# EAGLE schematic combined-v2 (EAGLE 9.6.2)
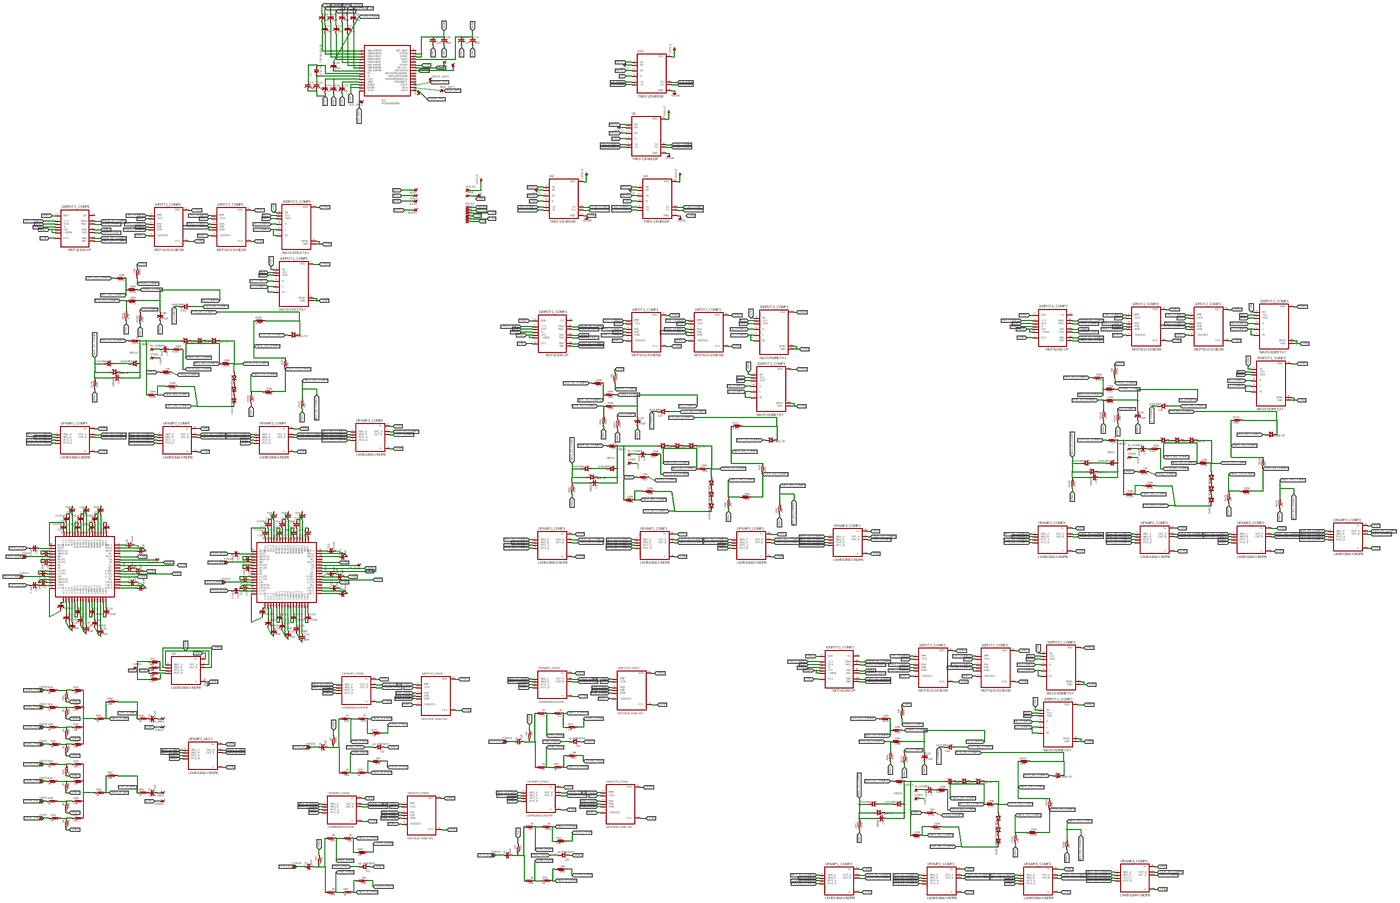
[diagram p0: schematic, sheet 1, overview]
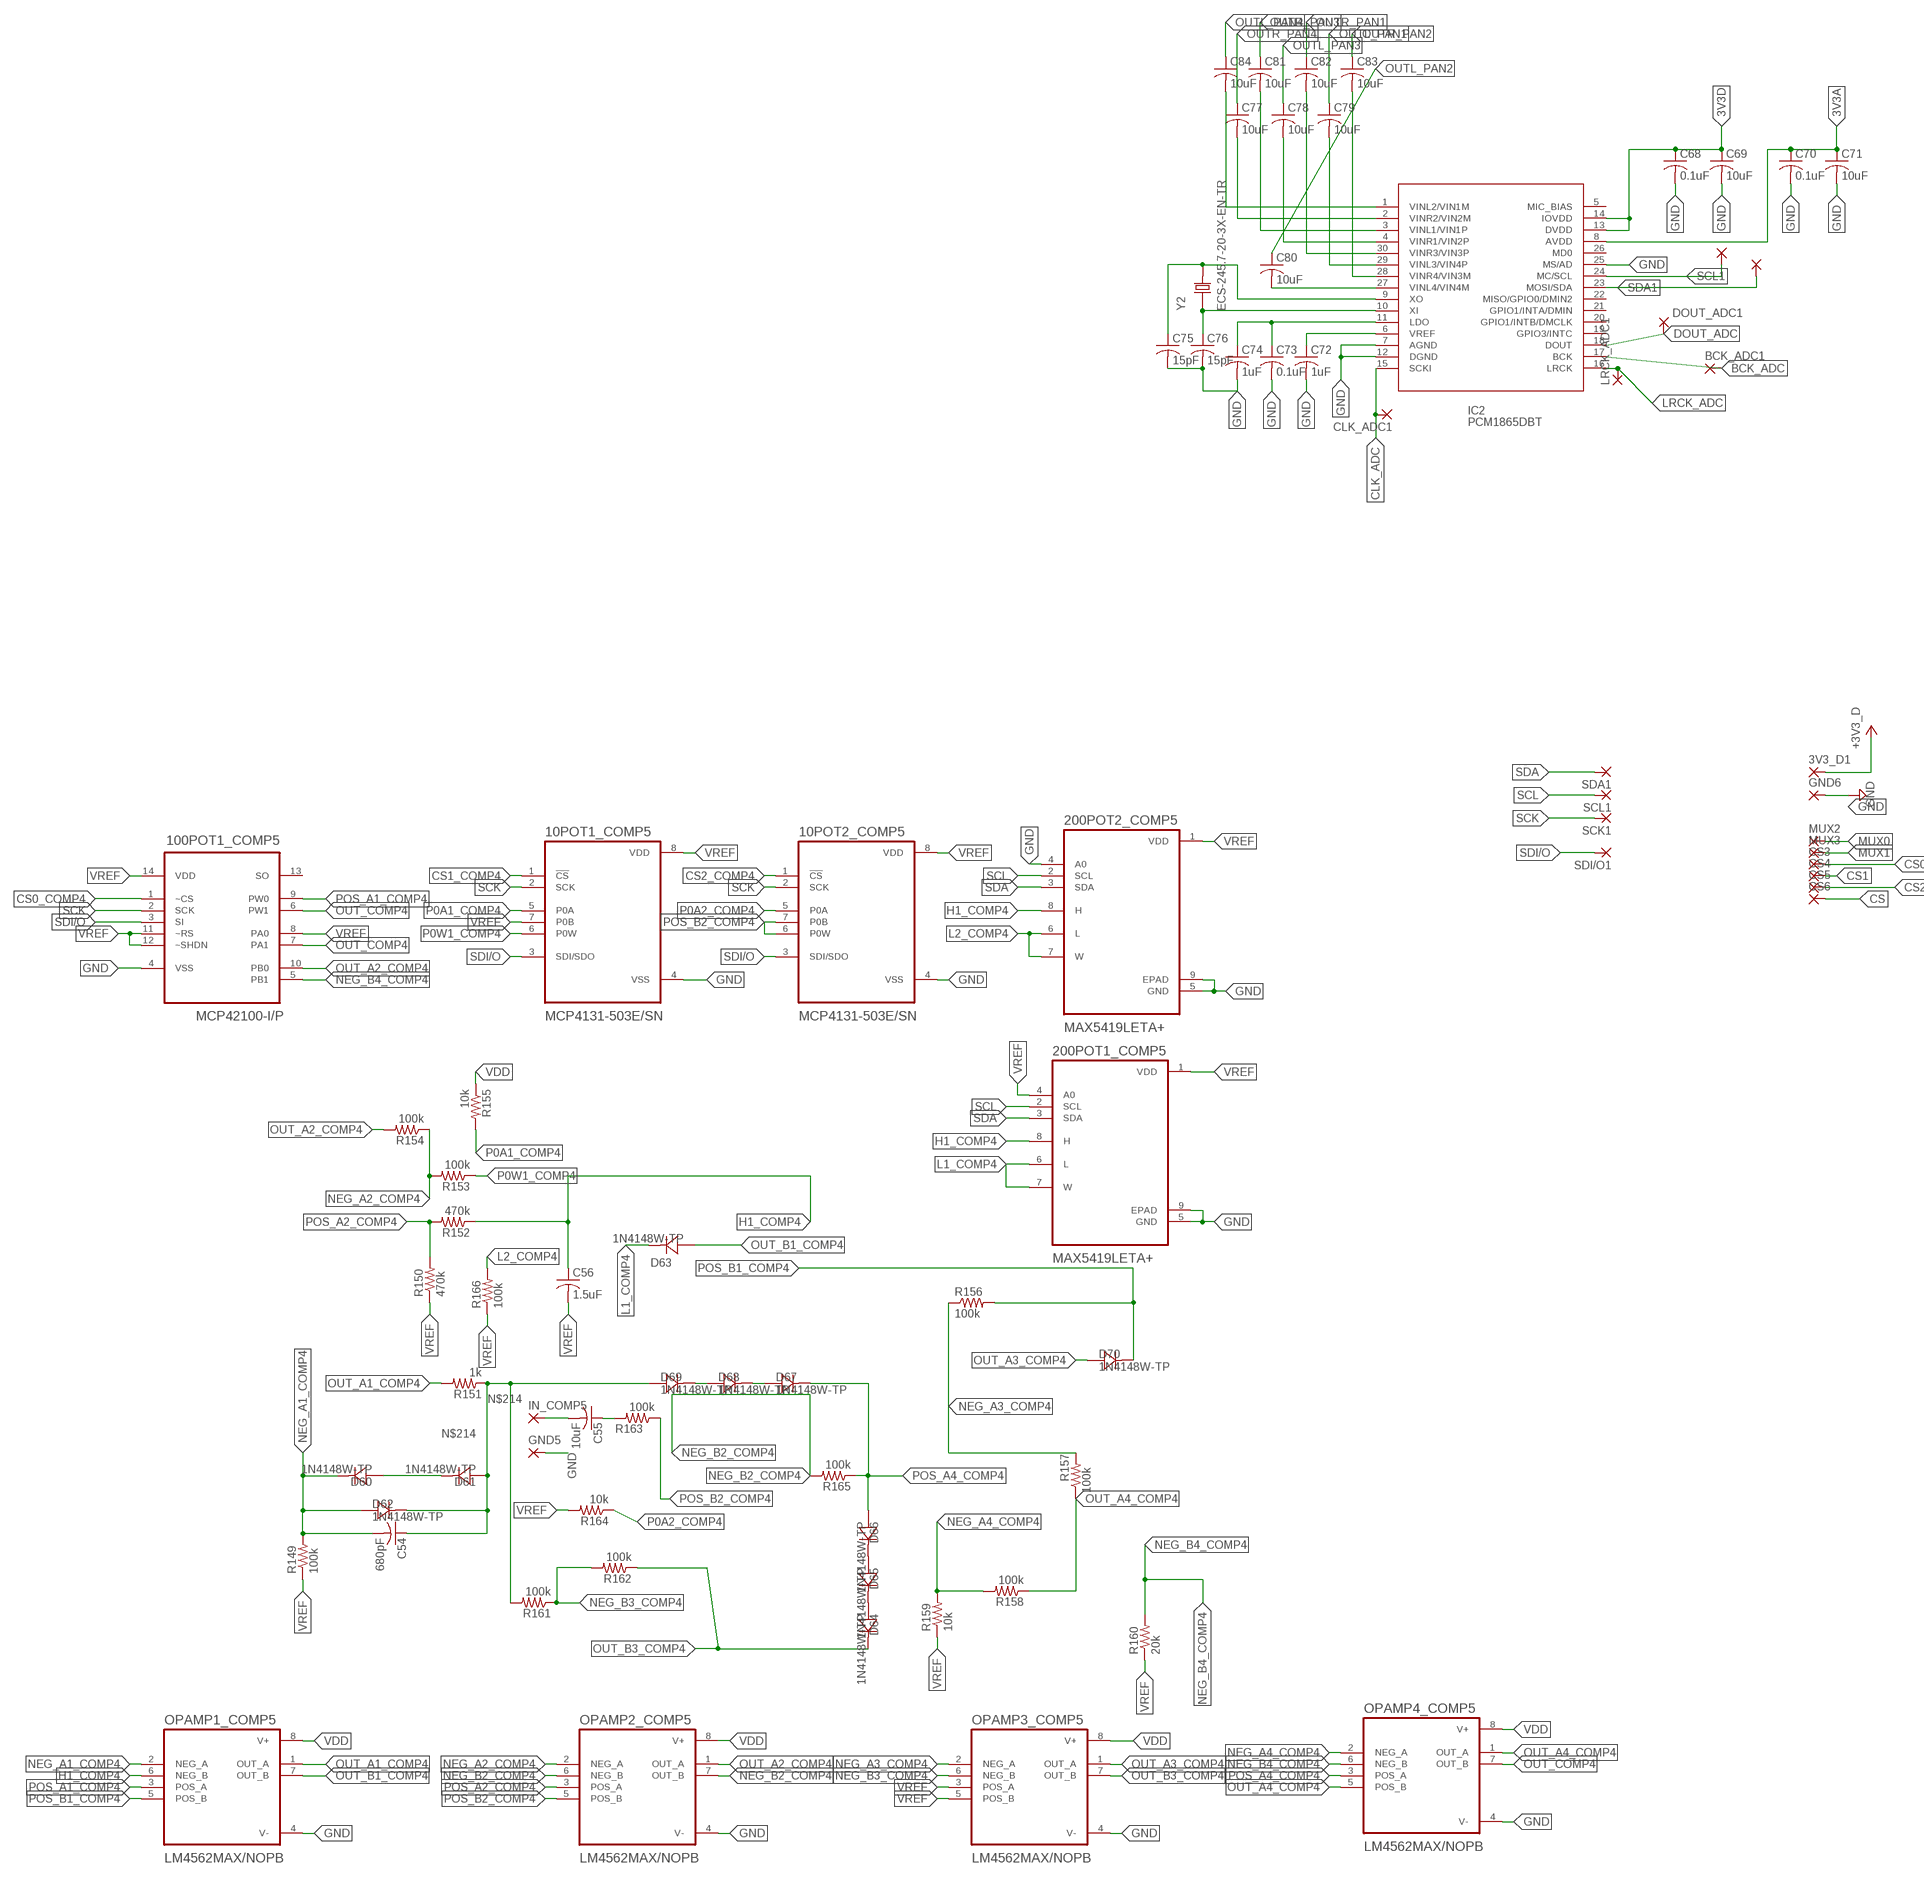
[diagram p1: schematic, sheet 1, part 1 of 5]
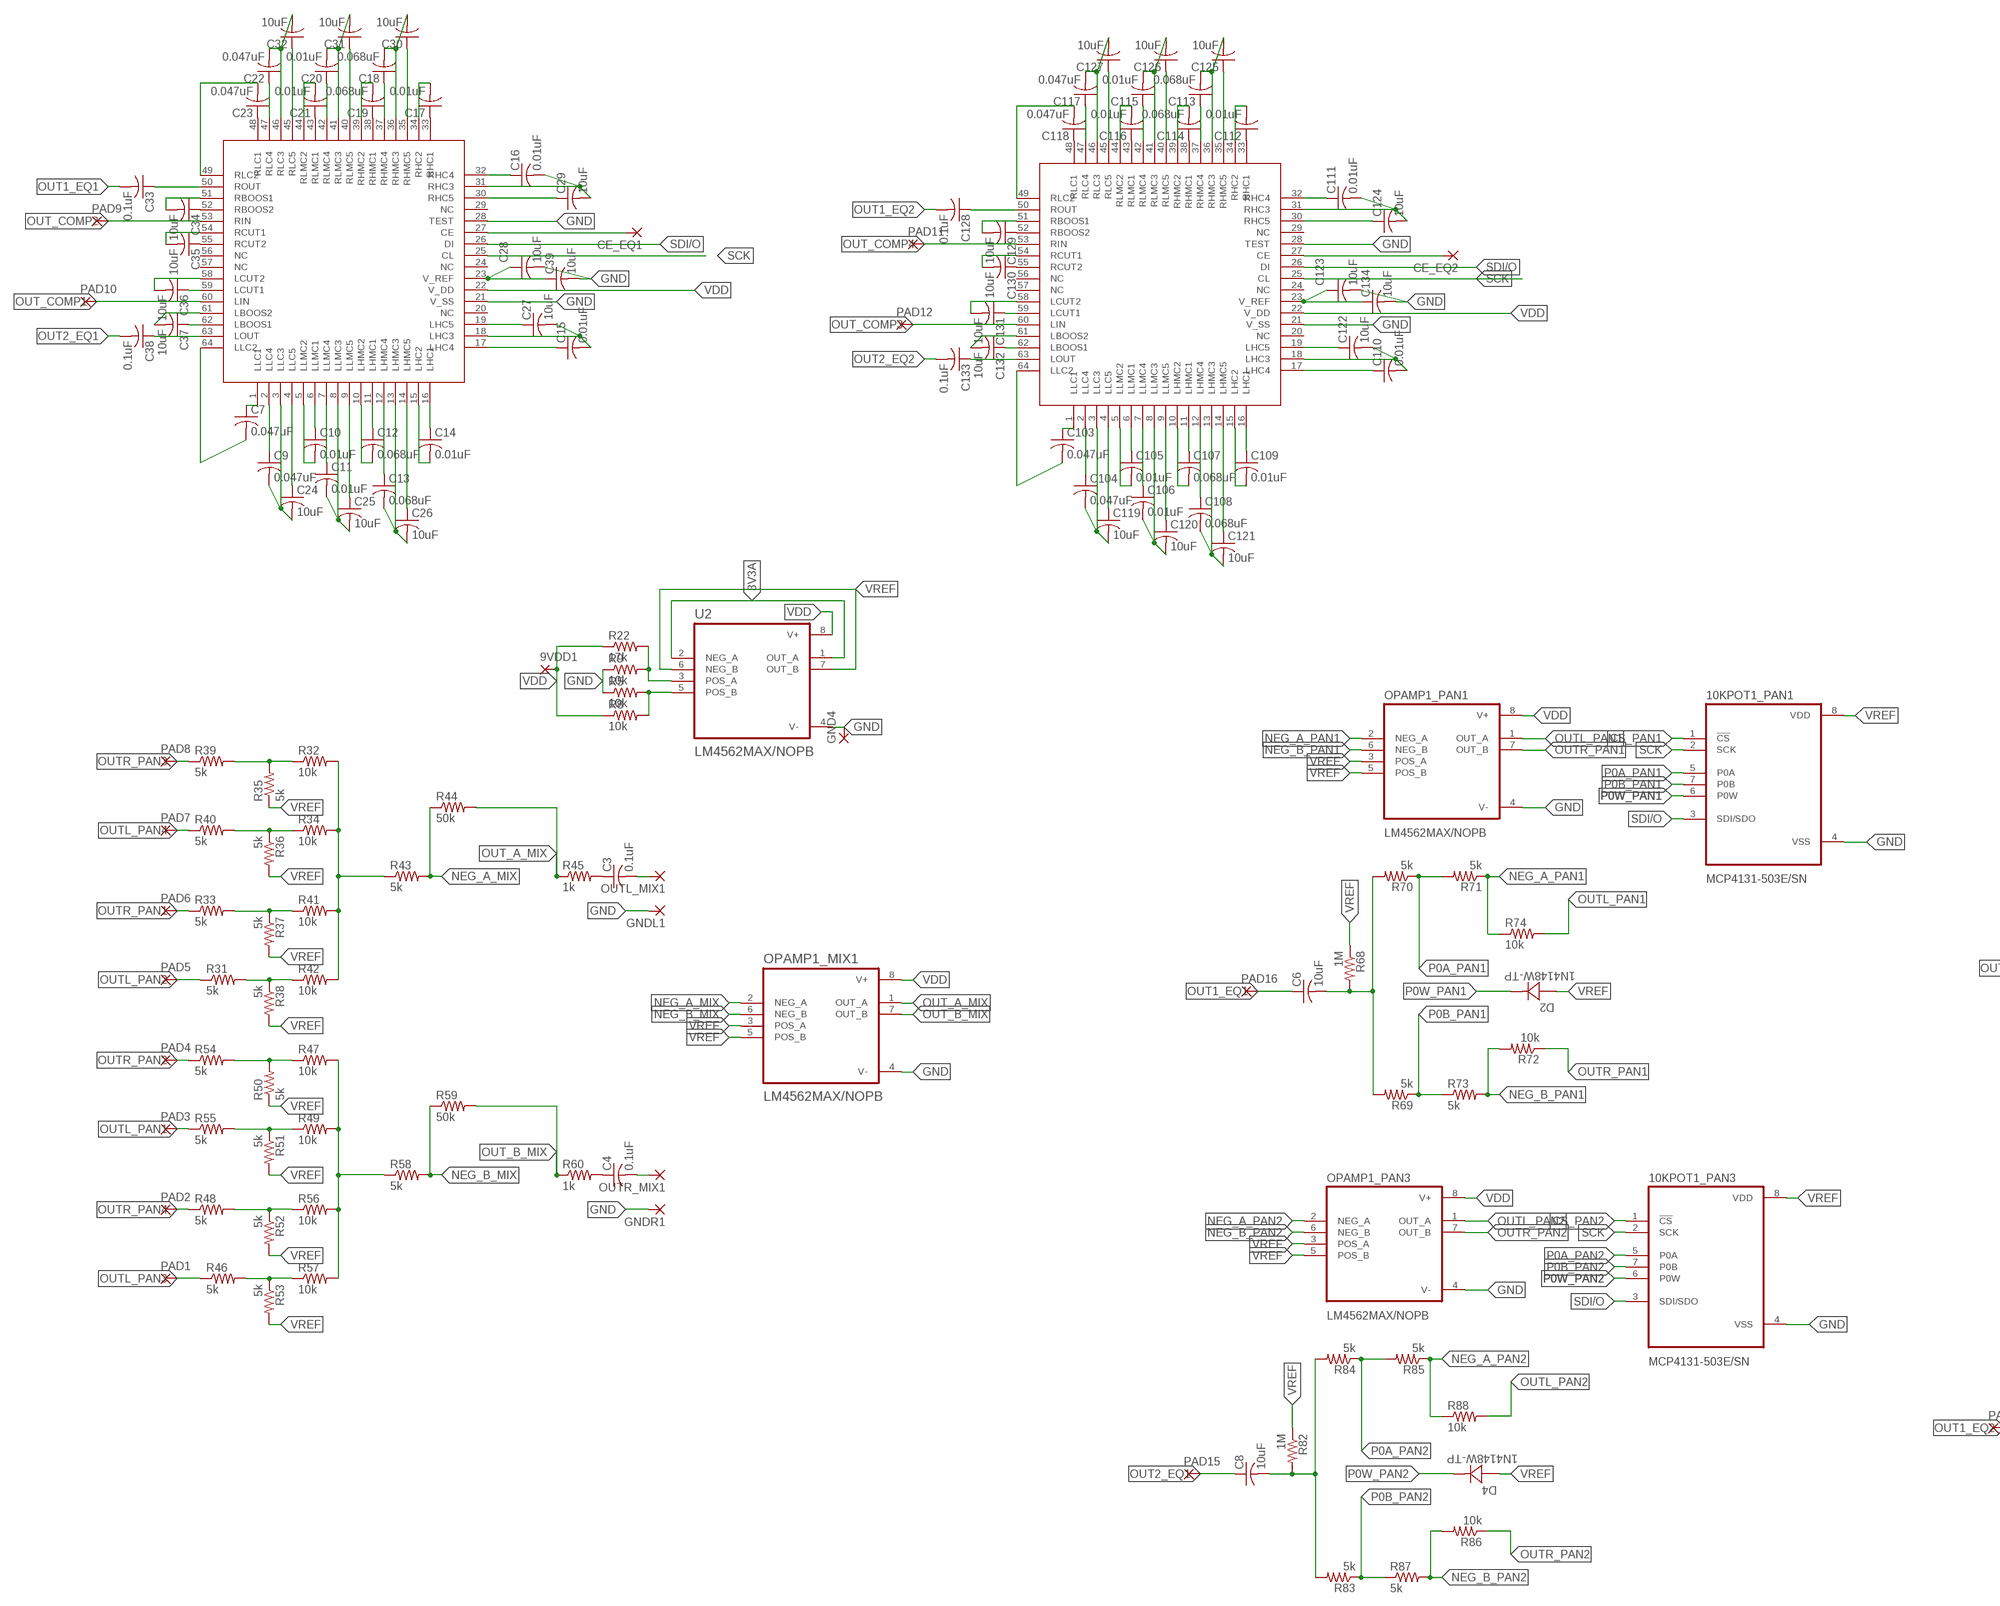
[diagram p2: schematic, sheet 1, part 2 of 5]
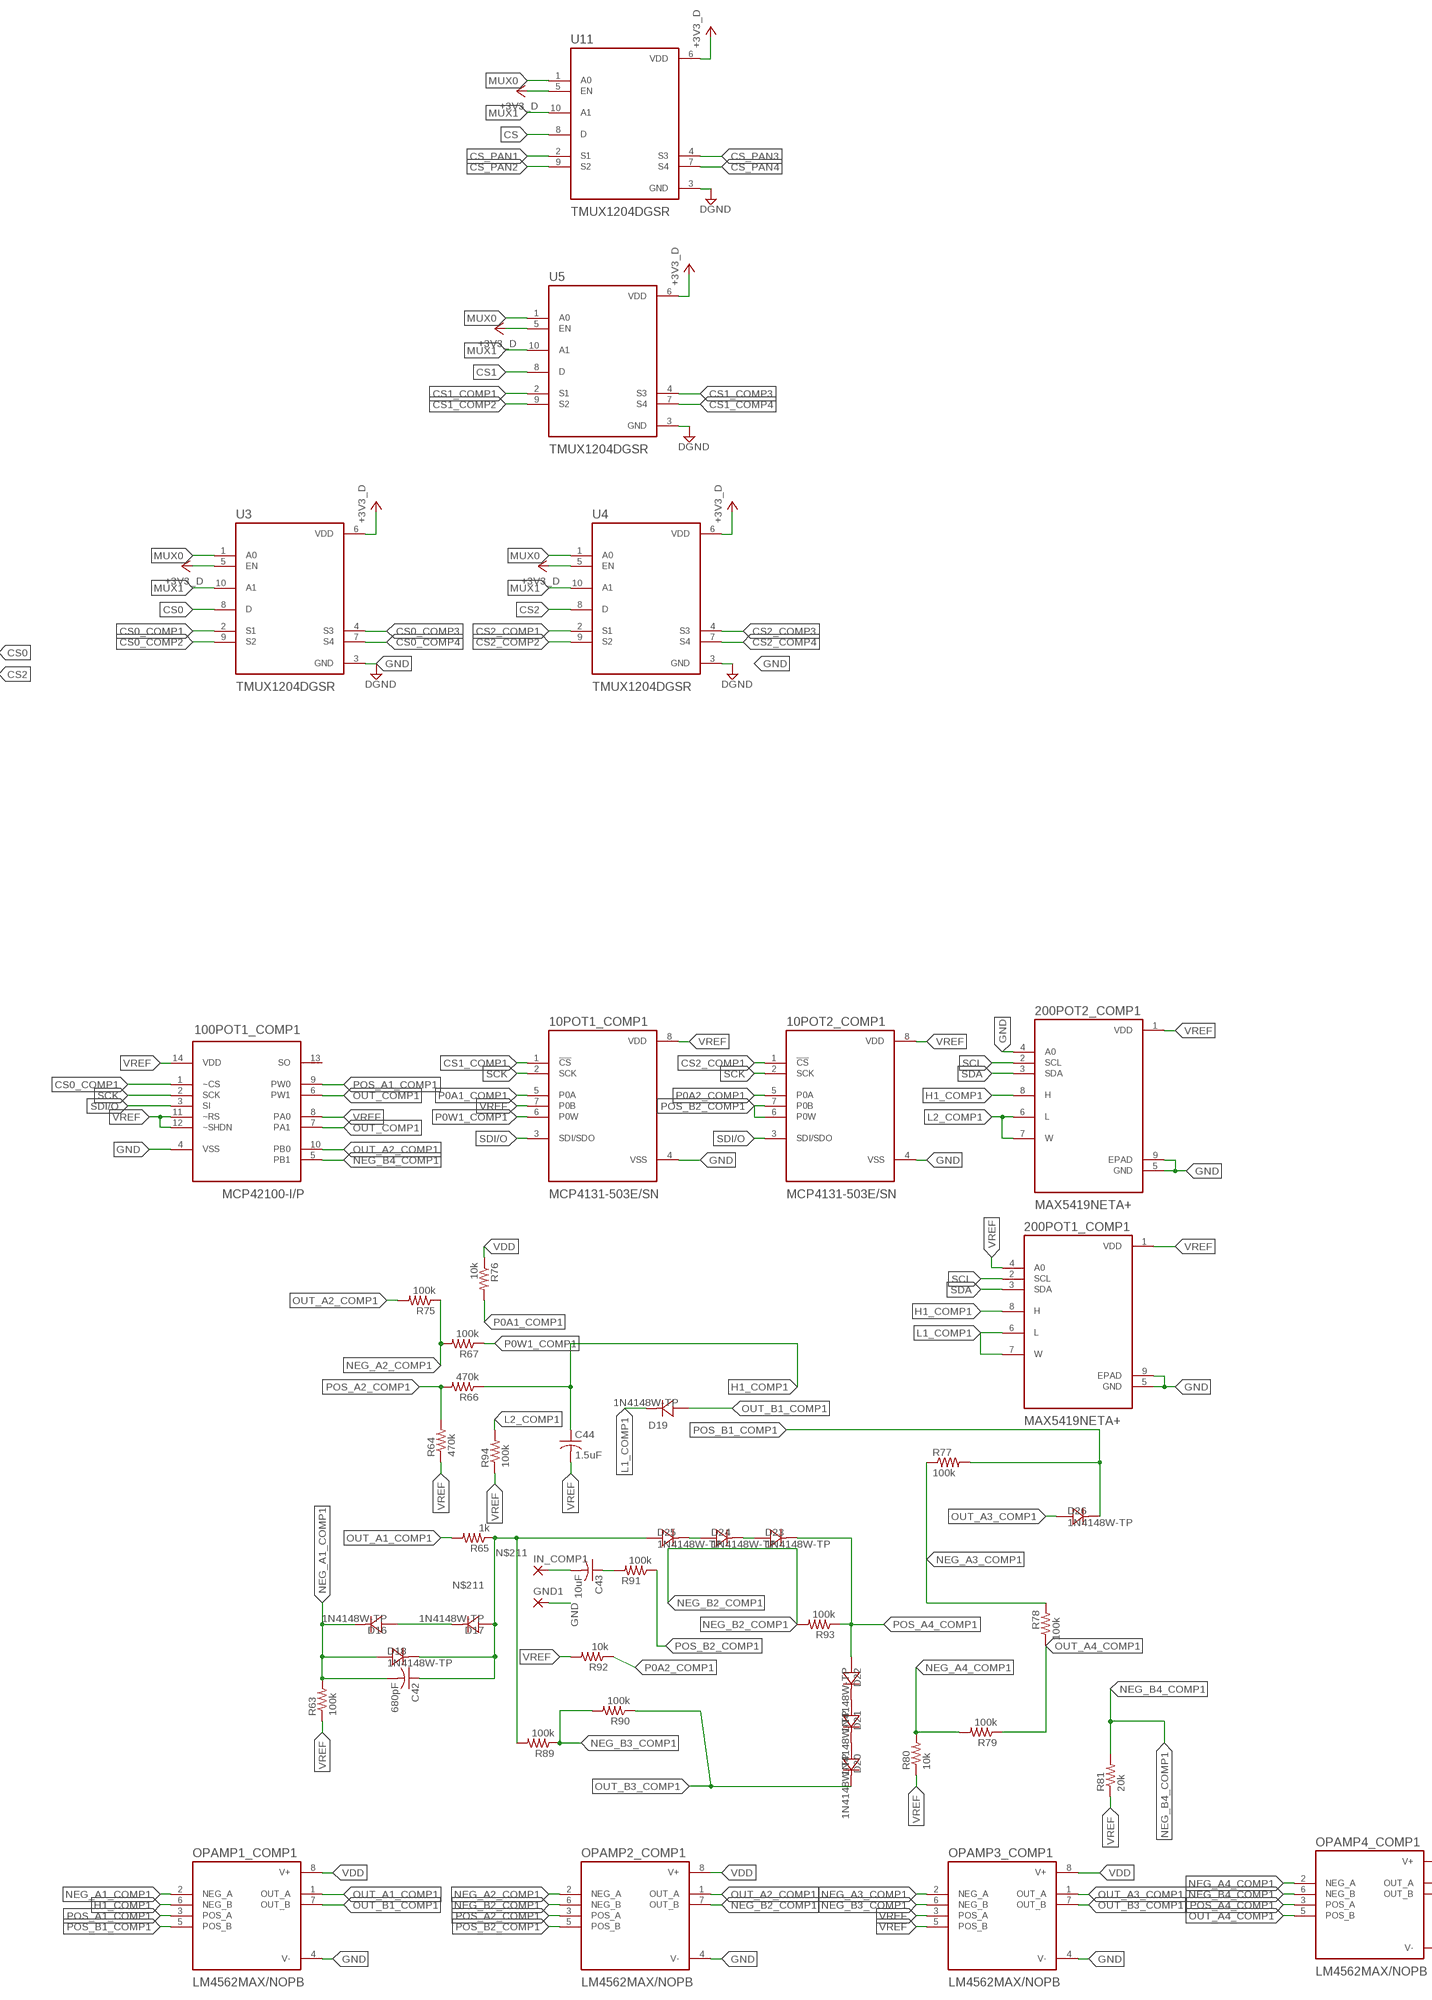
[diagram p3: schematic, sheet 1, part 3 of 5]
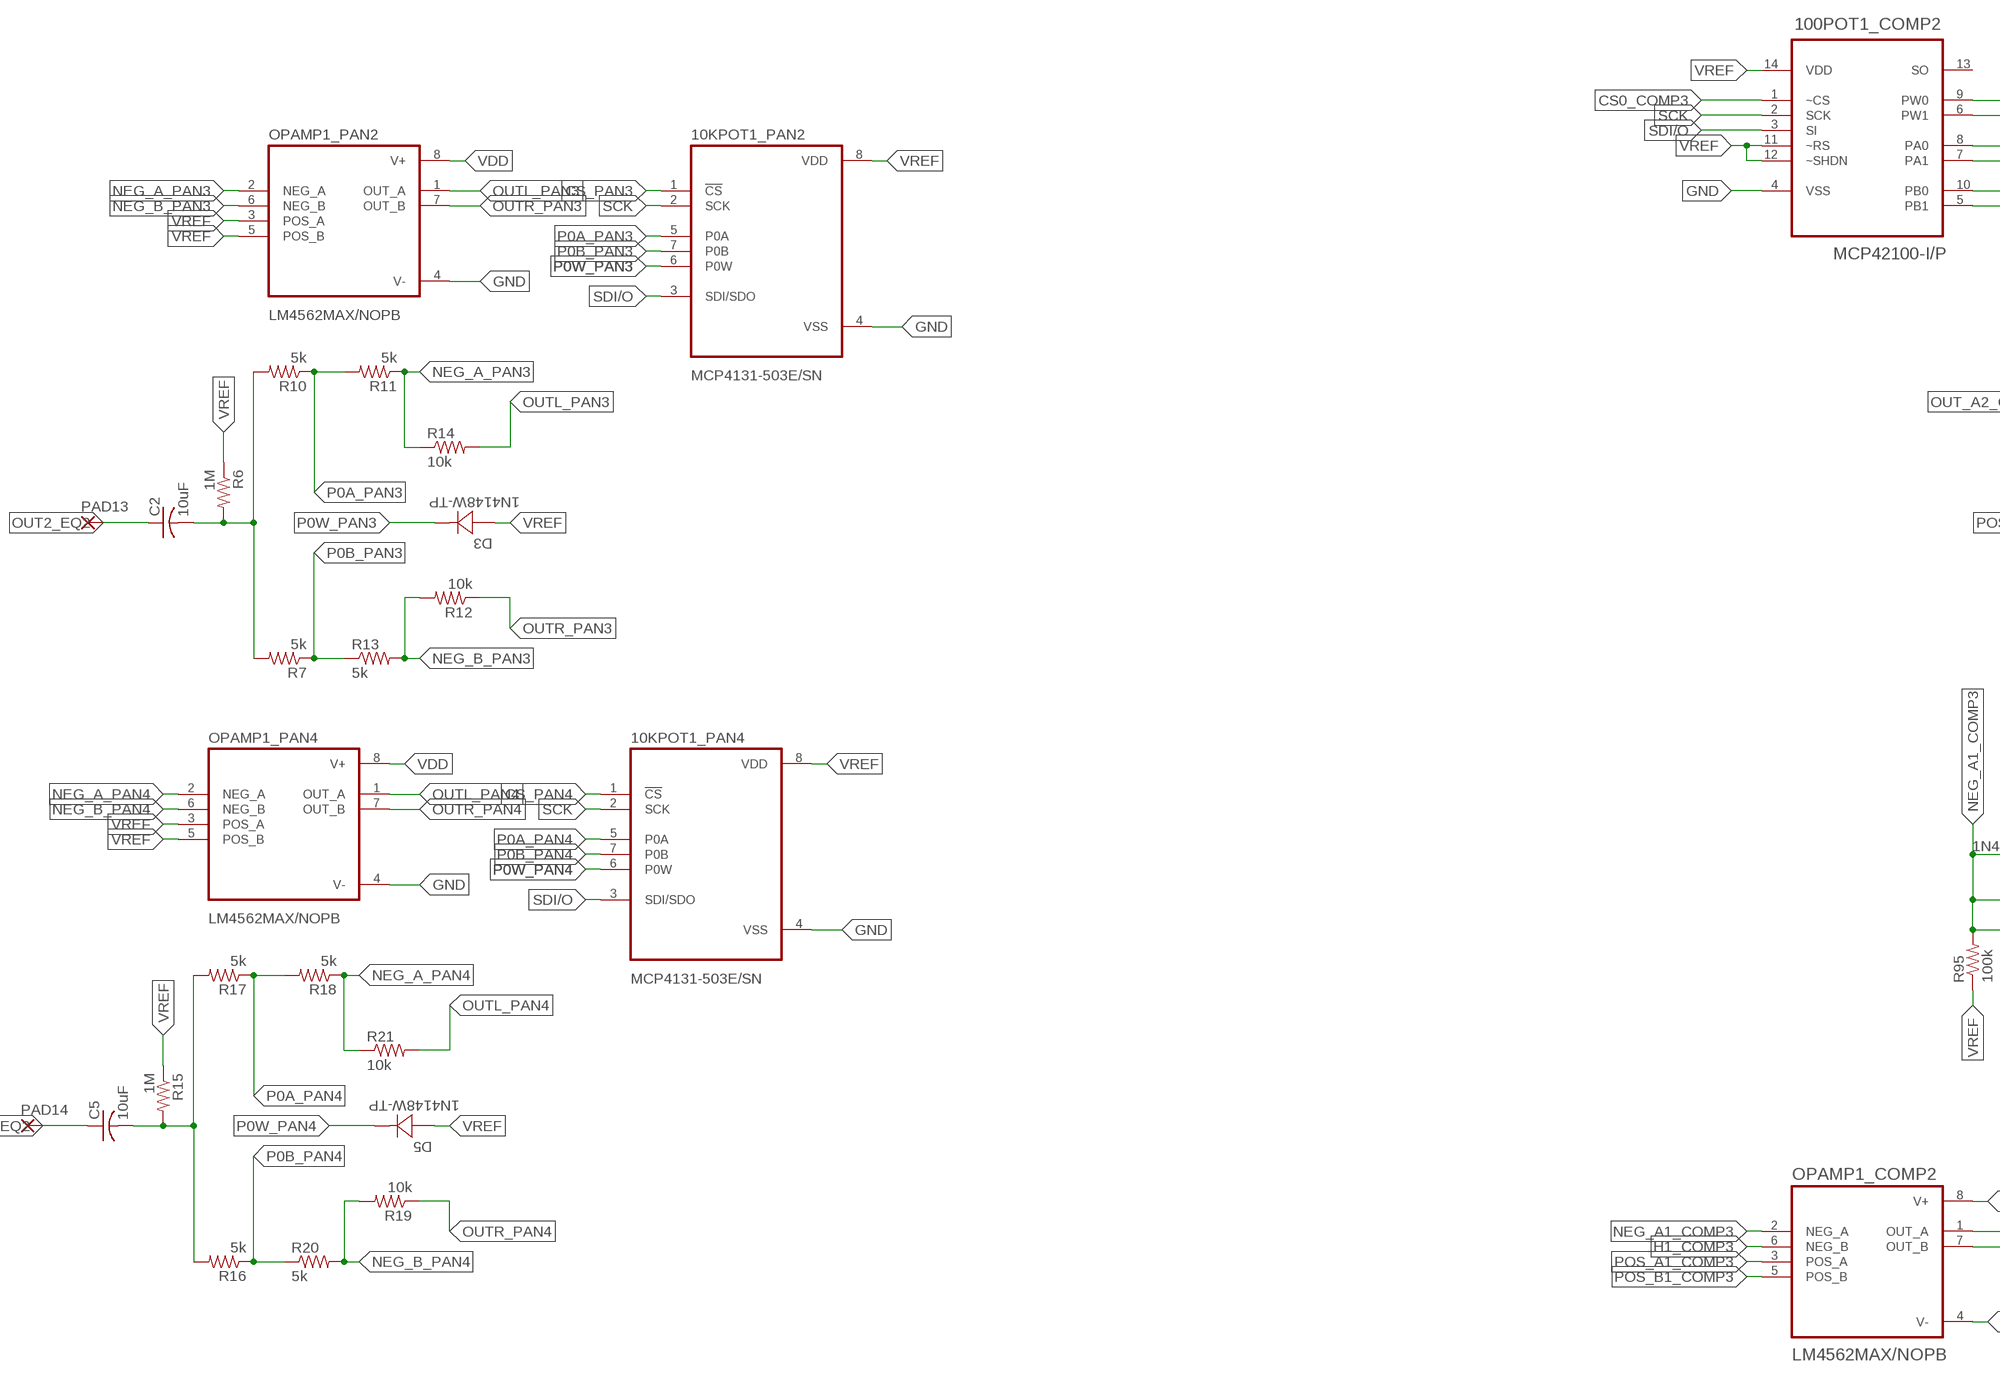
[diagram p4: schematic, sheet 1, part 4 of 5]
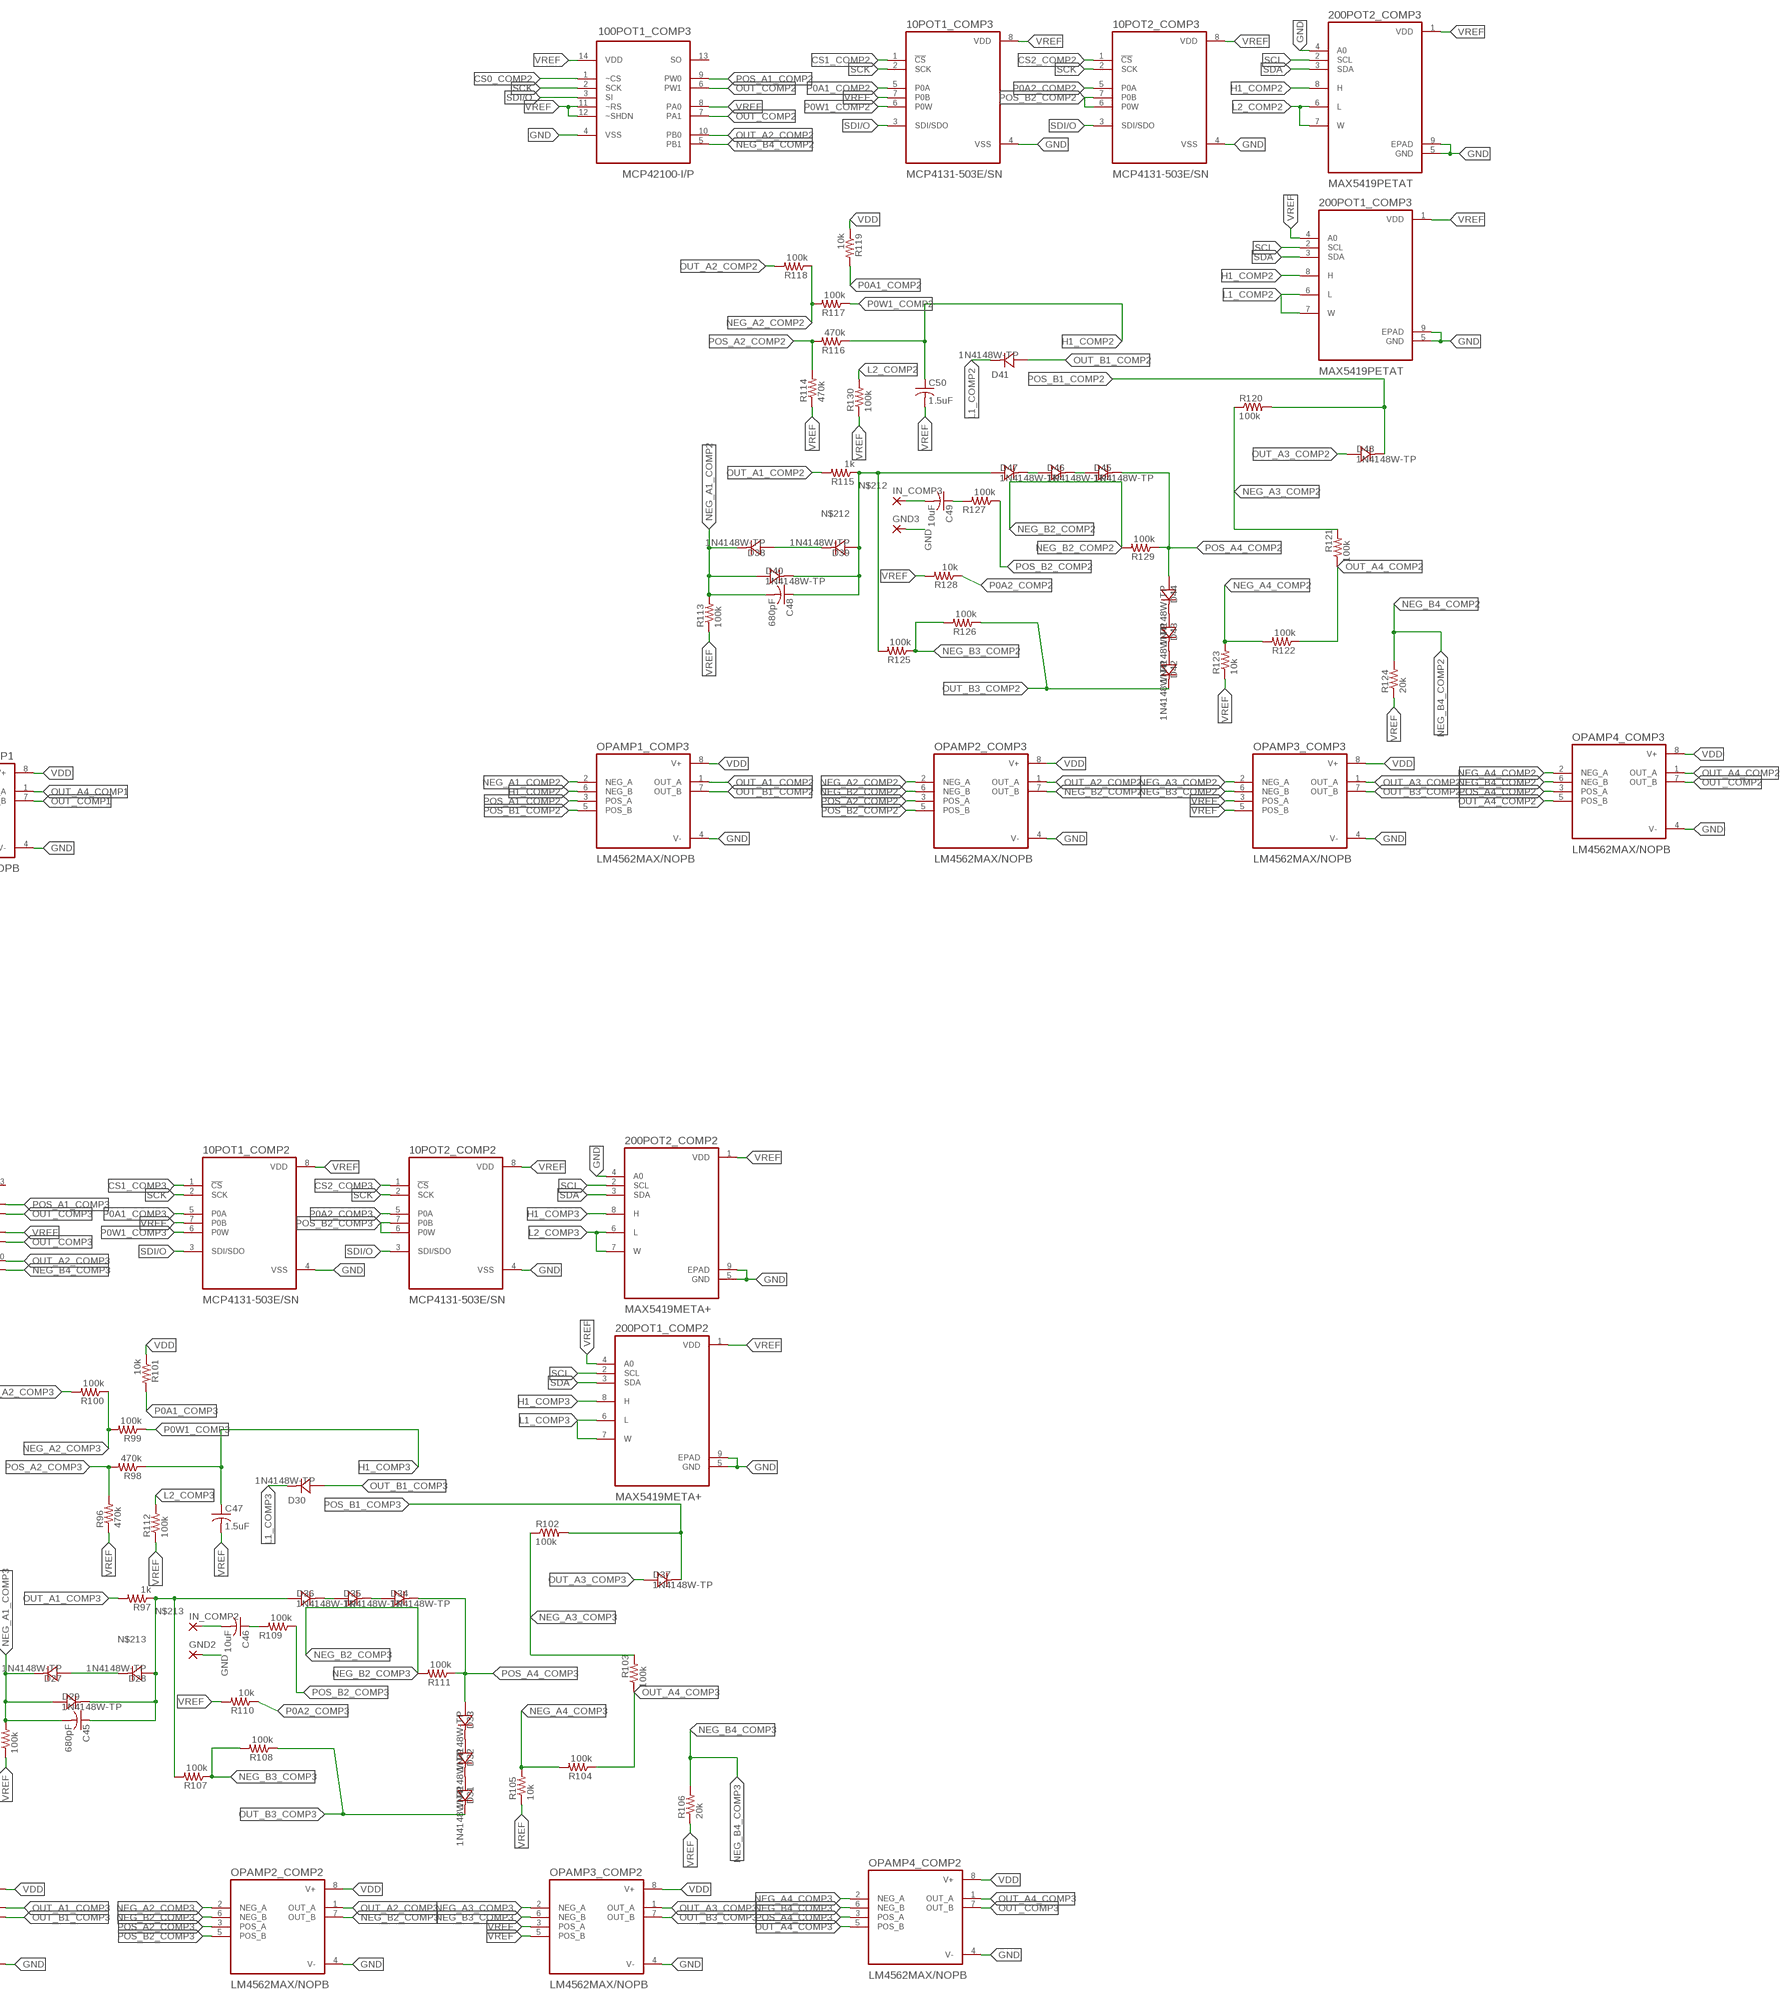
[diagram p5: schematic, sheet 1, part 5 of 5]

## Parts
3V3_D1  SMD2  [SMD1,27-2,54]
9VDD1  SMD2  [SMD1,27-2,54]
10KPOT1_PAN1  MCP4131-503E/SN  [SOIC127P599X175-8N]
10KPOT1_PAN2  MCP4131-503E/SN  [SOIC127P599X175-8N]
10KPOT1_PAN3  MCP4131-503E/SN  [SOIC127P599X175-8N]
10KPOT1_PAN4  MCP4131-503E/SN  [SOIC127P599X175-8N]
10POT1_COMP1  MCP4131-503E/SN  [SOIC127P599X175-8N]
10POT1_COMP2  MCP4131-503E/SN  [SOIC127P599X175-8N]
10POT1_COMP3  MCP4131-503E/SN  [SOIC127P599X175-8N]
10POT1_COMP5  MCP4131-503E/SN  [SOIC127P599X175-8N]
10POT2_COMP1  MCP4131-503E/SN  [SOIC127P599X175-8N]
10POT2_COMP2  MCP4131-503E/SN  [SOIC127P599X175-8N]
10POT2_COMP3  MCP4131-503E/SN  [SOIC127P599X175-8N]
10POT2_COMP5  MCP4131-503E/SN  [SOIC127P599X175-8N]
100POT1_COMP1  MCP42100-I/P  [DIP254P762X432-14]
100POT1_COMP2  MCP42100-I/P  [DIP254P762X432-14]
100POT1_COMP3  MCP42100-I/P  [DIP254P762X432-14]
100POT1_COMP5  MCP42100-I/P  [DIP254P762X432-14]
200POT1_COMP1  MAX5419NETA+  [SON65P300X300X80-9N]
200POT1_COMP2  MAX5419META+  [SON65P300X300X80-9N]
200POT1_COMP3  MAX5419PETAT  [SON65P300X300X80-9N]
200POT1_COMP5  MAX5419LETA+  [SON65P300X300X80-9N]
200POT2_COMP1  MAX5419NETA+  [SON65P300X300X80-9N]
200POT2_COMP2  MAX5419META+  [SON65P300X300X80-9N]
200POT2_COMP3  MAX5419PETAT  [SON65P300X300X80-9N]
200POT2_COMP5  MAX5419LETA+  [SON65P300X300X80-9N]
BCK_ADC1  SMD2  [SMD1,27-2,54]
C2  10uF  C-USC0402  [C0402]
C3  0.1uF  C-USC0402  [C0402]
C4  0.1uF  C-USC0402  [C0402]
C5  10uF  C-USC0402  [C0402]
C6  10uF  C-USC0402  [C0402]
C7  0.047uF  C-USC0402  [C0402]
C8  10uF  C-USC0402  [C0402]
C9  0.047uF  C-USC0402  [C0402]
C10  0.01uF  C-USC0402  [C0402]
C11  0.01uF  C-USC0402  [C0402]
C12  0.068uF  C-USC0402  [C0402]
C13  0.068uF  C-USC0402  [C0402]
C14  0.01uF  C-USC0402  [C0402]
C15  0.01uF  C-USC0402  [C0402]
C16  0.01uF  C-USC0402  [C0402]
C17  0.01uF  C-USC0402  [C0402]
C18  0.068uF  C-USC0402  [C0402]
C19  0.068uF  C-USC0402  [C0402]
C20  0.01uF  C-USC0402  [C0402]
C21  0.01uF  C-USC0402  [C0402]
C22  0.047uF  C-USC0402  [C0402]
C23  0.047uF  C-USC0402  [C0402]
C24  10uF  C-USC0402  [C0402]
C25  10uF  C-USC0402  [C0402]
C26  10uF  C-USC0402  [C0402]
C27  10uF  C-USC0402  [C0402]
C28  10uF  C-USC0402  [C0402]
C29  10uF  C-USC0402  [C0402]
C30  10uF  C-USC0402  [C0402]
C31  10uF  C-USC0402  [C0402]
C32  10uF  C-USC0402  [C0402]
C33  0.1uF  C-USC0402  [C0402]
C34  10uF  C-USC0402  [C0402]
C35  10uF  C-USC0402  [C0402]
C36  10uF  C-USC0402  [C0402]
C37  10uF  C-USC0402  [C0402]
C38  0.1uF  C-USC0402  [C0402]
C39  10uF  C-USC0402  [C0402]
C42  680pF  C-USC0402  [C0402]
C43  10uF  C-USC0402  [C0402]
C44  1.5uF  C-USC0402  [C0402]
C45  680pF  C-USC0402  [C0402]
C46  10uF  C-USC0402  [C0402]
C47  1.5uF  C-USC0402  [C0402]
C48  680pF  C-USC0402  [C0402]
C49  10uF  C-USC0402  [C0402]
C50  1.5uF  C-USC0402  [C0402]
C54  680pF  C-USC0402  [C0402]
C55  10uF  C-USC0402  [C0402]
C56  1.5uF  C-USC0402  [C0402]
C68  0.1uF  C-USC0402  [C0402]
C69  10uF  C-USC0402  [C0402]
C70  0.1uF  C-USC0402  [C0402]
C71  10uF  C-USC0402  [C0402]
C72  1uF  C-USC0402  [C0402]
C73  0.1uF  C-USC0402  [C0402]
C74  1uF  C-USC0402  [C0402]
C75  15pF  C-USC0402  [C0402]
C76  15pF  C-USC0402  [C0402]
C77  10uF  C-USC0402  [C0402]
C78  10uF  C-USC0402  [C0402]
C79  10uF  C-USC0402  [C0402]
C80  10uF  C-USC0402  [C0402]
C81  10uF  C-USC0402  [C0402]
C82  10uF  C-USC0402  [C0402]
C83  10uF  C-USC0402  [C0402]
C84  10uF  C-USC0402  [C0402]
C103  0.047uF  C-USC0402  [C0402]
C104  0.047uF  C-USC0402  [C0402]
C105  0.01uF  C-USC0402  [C0402]
C106  0.01uF  C-USC0402  [C0402]
C107  0.068uF  C-USC0402  [C0402]
C108  0.068uF  C-USC0402  [C0402]
C109  0.01uF  C-USC0402  [C0402]
C110  0.01uF  C-USC0402  [C0402]
C111  0.01uF  C-USC0402  [C0402]
C112  0.01uF  C-USC0402  [C0402]
C113  0.068uF  C-USC0402  [C0402]
C114  0.068uF  C-USC0402  [C0402]
C115  0.01uF  C-USC0402  [C0402]
C116  0.01uF  C-USC0402  [C0402]
C117  0.047uF  C-USC0402  [C0402]
C118  0.047uF  C-USC0402  [C0402]
C119  10uF  C-USC0402  [C0402]
C120  10uF  C-USC0402  [C0402]
C121  10uF  C-USC0402  [C0402]
C122  10uF  C-USC0402  [C0402]
C123  10uF  C-USC0402  [C0402]
C124  10uF  C-USC0402  [C0402]
C125  10uF  C-USC0402  [C0402]
C126  10uF  C-USC0402  [C0402]
C127  10uF  C-USC0402  [C0402]
C128  0.1uF  C-USC0402  [C0402]
C129  10uF  C-USC0402  [C0402]
C130  10uF  C-USC0402  [C0402]
C131  10uF  C-USC0402  [C0402]
C132  10uF  C-USC0402  [C0402]
C133  0.1uF  C-USC0402  [C0402]
C134  10uF  C-USC0402  [C0402]
CE_EQ1  SMD2  [SMD1,27-2,54]
CE_EQ2  SMD2  [SMD1,27-2,54]
CLK_ADC1  SMD2  [SMD1,27-2,54]
CS3  SMD2  [SMD1,27-2,54]
CS4  SMD2  [SMD1,27-2,54]
CS5  SMD2  [SMD1,27-2,54]
CS6  SMD2  [SMD1,27-2,54]
D2  1N4148W-TP  [SOD123]
D3  1N4148W-TP  [SOD123]
D4  1N4148W-TP  [SOD123]
D5  1N4148W-TP  [SOD123]
D16  1N4148W-TP  [SOD123]
D17  1N4148W-TP  [SOD123]
D18  1N4148W-TP  [SOD123]
D19  1N4148W-TP  [SOD123]
D20  1N4148W-TP  [SOD123]
D21  1N4148W-TP  [SOD123]
D22  1N4148W-TP  [SOD123]
D23  1N4148W-TP  [SOD123]
D24  1N4148W-TP  [SOD123]
D25  1N4148W-TP  [SOD123]
D26  1N4148W-TP  [SOD123]
D27  1N4148W-TP  [SOD123]
D28  1N4148W-TP  [SOD123]
D29  1N4148W-TP  [SOD123]
D30  1N4148W-TP  [SOD123]
D31  1N4148W-TP  [SOD123]
D32  1N4148W-TP  [SOD123]
D33  1N4148W-TP  [SOD123]
D34  1N4148W-TP  [SOD123]
D35  1N4148W-TP  [SOD123]
D36  1N4148W-TP  [SOD123]
D37  1N4148W-TP  [SOD123]
D38  1N4148W-TP  [SOD123]
D39  1N4148W-TP  [SOD123]
D40  1N4148W-TP  [SOD123]
D41  1N4148W-TP  [SOD123]
D42  1N4148W-TP  [SOD123]
D43  1N4148W-TP  [SOD123]
D44  1N4148W-TP  [SOD123]
D45  1N4148W-TP  [SOD123]
D46  1N4148W-TP  [SOD123]
D47  1N4148W-TP  [SOD123]
D48  1N4148W-TP  [SOD123]
D60  1N4148W-TP  [SOD123]
D61  1N4148W-TP  [SOD123]
D62  1N4148W-TP  [SOD123]
D63  1N4148W-TP  [SOD123]
D64  1N4148W-TP  [SOD123]
D65  1N4148W-TP  [SOD123]
D66  1N4148W-TP  [SOD123]
D67  1N4148W-TP  [SOD123]
D68  1N4148W-TP  [SOD123]
D69  1N4148W-TP  [SOD123]
D70  1N4148W-TP  [SOD123]
DOUT_ADC1  SMD2  [SMD1,27-2,54]
GND1  SMD5  [SMD2,54-5,08]
GND2  SMD5  [SMD2,54-5,08]
GND3  SMD5  [SMD2,54-5,08]
GND4  SMD2  [SMD1,27-2,54]
GND5  SMD5  [SMD2,54-5,08]
GND6  SMD2  [SMD1,27-2,54]
GNDL1  SMD5  [SMD2,54-5,08]
GNDR1  SMD5  [SMD2,54-5,08]
IC2  PCM1865DBT  [TSSOP-30]
IN_COMP1  SMD5  [SMD2,54-5,08]
IN_COMP2  SMD5  [SMD2,54-5,08]
IN_COMP3  SMD5  [SMD2,54-5,08]
IN_COMP5  SMD5  [SMD2,54-5,08]
LRCK_ADC1  SMD2  [SMD1,27-2,54]
MUX2  SMD2  [SMD1,27-2,54]
MUX3  SMD2  [SMD1,27-2,54]
OPAMP1_COMP1  LM4562MAX/NOPB  [SOIC127P599X175-8N]
OPAMP1_COMP2  LM4562MAX/NOPB  [SOIC127P599X175-8N]
OPAMP1_COMP3  LM4562MAX/NOPB  [SOIC127P599X175-8N]
OPAMP1_COMP5  LM4562MAX/NOPB  [SOIC127P599X175-8N]
OPAMP1_MIX1  LM4562MAX/NOPB  [SOIC127P599X175-8N]
OPAMP1_PAN1  LM4562MAX/NOPB  [SOIC127P599X175-8N]
OPAMP1_PAN2  LM4562MAX/NOPB  [SOIC127P599X175-8N]
OPAMP1_PAN3  LM4562MAX/NOPB  [SOIC127P599X175-8N]
OPAMP1_PAN4  LM4562MAX/NOPB  [SOIC127P599X175-8N]
OPAMP2_COMP1  LM4562MAX/NOPB  [SOIC127P599X175-8N]
OPAMP2_COMP2  LM4562MAX/NOPB  [SOIC127P599X175-8N]
OPAMP2_COMP3  LM4562MAX/NOPB  [SOIC127P599X175-8N]
OPAMP2_COMP5  LM4562MAX/NOPB  [SOIC127P599X175-8N]
OPAMP3_COMP1  LM4562MAX/NOPB  [SOIC127P599X175-8N]
OPAMP3_COMP2  LM4562MAX/NOPB  [SOIC127P599X175-8N]
OPAMP3_COMP3  LM4562MAX/NOPB  [SOIC127P599X175-8N]
OPAMP3_COMP5  LM4562MAX/NOPB  [SOIC127P599X175-8N]
OPAMP4_COMP1  LM4562MAX/NOPB  [SOIC127P599X175-8N]
OPAMP4_COMP2  LM4562MAX/NOPB  [SOIC127P599X175-8N]
OPAMP4_COMP3  LM4562MAX/NOPB  [SOIC127P599X175-8N]
OPAMP4_COMP5  LM4562MAX/NOPB  [SOIC127P599X175-8N]
OUTL_MIX1  SMD5  [SMD2,54-5,08]
OUTR_MIX1  SMD5  [SMD2,54-5,08]
PAD1  SMD2  [SMD1,27-2,54]
PAD2  SMD2  [SMD1,27-2,54]
PAD3  SMD2  [SMD1,27-2,54]
PAD4  SMD2  [SMD1,27-2,54]
PAD5  SMD2  [SMD1,27-2,54]
PAD6  SMD2  [SMD1,27-2,54]
PAD7  SMD2  [SMD1,27-2,54]
PAD8  SMD2  [SMD1,27-2,54]
PAD9  SMD2  [SMD1,27-2,54]
PAD10  SMD2  [SMD1,27-2,54]
PAD11  SMD2  [SMD1,27-2,54]
PAD12  SMD2  [SMD1,27-2,54]
PAD13  SMD2  [SMD1,27-2,54]
PAD14  SMD2  [SMD1,27-2,54]
PAD15  SMD2  [SMD1,27-2,54]
PAD16  SMD2  [SMD1,27-2,54]
R5  10k  R-US_R0402  [R0402]
R6  1M  R-US_R0402  [R0402]
R7  5k  R-US_R0402  [R0402]
R8  10k  R-US_R0402  [R0402]
R9  10k  R-US_R0402  [R0402]
R10  5k  R-US_R0402  [R0402]
R11  5k  R-US_R0402  [R0402]
R12  10k  R-US_R0402  [R0402]
R13  5k  R-US_R0402  [R0402]
R14  10k  R-US_R0402  [R0402]
R15  1M  R-US_R0402  [R0402]
R16  5k  R-US_R0402  [R0402]
R17  5k  R-US_R0402  [R0402]
R18  5k  R-US_R0402  [R0402]
R19  10k  R-US_R0402  [R0402]
R20  5k  R-US_R0402  [R0402]
R21  10k  R-US_R0402  [R0402]
R22  17k  R-US_R0402  [R0402]
R31  5k  R-US_R0402  [R0402]
R32  10k  R-US_R0402  [R0402]
R33  5k  R-US_R0402  [R0402]
R34  10k  R-US_R0402  [R0402]
R35  5k  R-US_R0402  [R0402]
R36  5k  R-US_R0402  [R0402]
R37  5k  R-US_R0402  [R0402]
R38  5k  R-US_R0402  [R0402]
R39  5k  R-US_R0402  [R0402]
R40  5k  R-US_R0402  [R0402]
R41  10k  R-US_R0402  [R0402]
R42  10k  R-US_R0402  [R0402]
R43  5k  R-US_R0402  [R0402]
R44  50k  R-US_R0402  [R0402]
R45  1k  R-US_R0402  [R0402]
R46  5k  R-US_R0402  [R0402]
R47  10k  R-US_R0402  [R0402]
R48  5k  R-US_R0402  [R0402]
R49  10k  R-US_R0402  [R0402]
R50  5k  R-US_R0402  [R0402]
R51  5k  R-US_R0402  [R0402]
R52  5k  R-US_R0402  [R0402]
R53  5k  R-US_R0402  [R0402]
R54  5k  R-US_R0402  [R0402]
R55  5k  R-US_R0402  [R0402]
R56  10k  R-US_R0402  [R0402]
R57  10k  R-US_R0402  [R0402]
R58  5k  R-US_R0402  [R0402]
R59  50k  R-US_R0402  [R0402]
R60  1k  R-US_R0402  [R0402]
R63  100k  R-US_R0402  [R0402]
R64  470k  R-US_R0402  [R0402]
R65  1k  R-US_R0402  [R0402]
R66  470k  R-US_R0402  [R0402]
R67  100k  R-US_R0402  [R0402]
R68  1M  R-US_R0402  [R0402]
R69  5k  R-US_R0402  [R0402]
R70  5k  R-US_R0402  [R0402]
R71  5k  R-US_R0402  [R0402]
R72  10k  R-US_R0402  [R0402]
R73  5k  R-US_R0402  [R0402]
R74  10k  R-US_R0402  [R0402]
R75  100k  R-US_R0402  [R0402]
R76  10k  R-US_R0402  [R0402]
R77  100k  R-US_R0402  [R0402]
R78  100k  R-US_R0402  [R0402]
R79  100k  R-US_R0402  [R0402]
R80  10k  R-US_R0402  [R0402]
R81  20k  R-US_R0402  [R0402]
R82  1M  R-US_R0402  [R0402]
R83  5k  R-US_R0402  [R0402]
R84  5k  R-US_R0402  [R0402]
R85  5k  R-US_R0402  [R0402]
R86  10k  R-US_R0402  [R0402]
R87  5k  R-US_R0402  [R0402]
R88  10k  R-US_R0402  [R0402]
R89  100k  R-US_R0402  [R0402]
R90  100k  R-US_R0402  [R0402]
R91  100k  R-US_R0402  [R0402]
R92  10k  R-US_R0402  [R0402]
R93  100k  R-US_R0402  [R0402]
R94  100k  R-US_R0402  [R0402]
R95  100k  R-US_R0402  [R0402]
R96  470k  R-US_R0402  [R0402]
R97  1k  R-US_R0402  [R0402]
R98  470k  R-US_R0402  [R0402]
R99  100k  R-US_R0402  [R0402]
R100  100k  R-US_R0402  [R0402]
R101  10k  R-US_R0402  [R0402]
R102  100k  R-US_R0402  [R0402]
R103  100k  R-US_R0402  [R0402]
R104  100k  R-US_R0402  [R0402]
R105  10k  R-US_R0402  [R0402]
R106  20k  R-US_R0402  [R0402]
R107  100k  R-US_R0402  [R0402]
R108  100k  R-US_R0402  [R0402]
R109  100k  R-US_R0402  [R0402]
R110  10k  R-US_R0402  [R0402]
R111  100k  R-US_R0402  [R0402]
R112  100k  R-US_R0402  [R0402]
R113  100k  R-US_R0402  [R0402]
R114  470k  R-US_R0402  [R0402]
R115  1k  R-US_R0402  [R0402]
R116  470k  R-US_R0402  [R0402]
R117  100k  R-US_R0402  [R0402]
R118  100k  R-US_R0402  [R0402]
R119  10k  R-US_R0402  [R0402]
R120  100k  R-US_R0402  [R0402]
R121  100k  R-US_R0402  [R0402]
R122  100k  R-US_R0402  [R0402]
R123  10k  R-US_R0402  [R0402]
R124  20k  R-US_R0402  [R0402]
R125  100k  R-US_R0402  [R0402]
R126  100k  R-US_R0402  [R0402]
R127  100k  R-US_R0402  [R0402]
R128  10k  R-US_R0402  [R0402]
R129  100k  R-US_R0402  [R0402]
R130  100k  R-US_R0402  [R0402]
R149  100k  R-US_R0402  [R0402]
R150  470k  R-US_R0402  [R0402]
R151  1k  R-US_R0402  [R0402]
R152  470k  R-US_R0402  [R0402]
R153  100k  R-US_R0402  [R0402]
R154  100k  R-US_R0402  [R0402]
R155  10k  R-US_R0402  [R0402]
R156  100k  R-US_R0402  [R0402]
R157  100k  R-US_R0402  [R0402]
R158  100k  R-US_R0402  [R0402]
R159  10k  R-US_R0402  [R0402]
R160  20k  R-US_R0402  [R0402]
R161  100k  R-US_R0402  [R0402]
R162  100k  R-US_R0402  [R0402]
R163  100k  R-US_R0402  [R0402]
R164  10k  R-US_R0402  [R0402]
R165  100k  R-US_R0402  [R0402]
R166  100k  R-US_R0402  [R0402]
SCK1  SMD2  [SMD1,27-2,54]
SCL1  SMD2  [SMD1,27-2,54]
SCL2  SMD2  [SMD1,27-2,54]
SDA1  SMD2  [SMD1,27-2,54]
SDA2  SMD2  [SMD1,27-2,54]
SDI/O1  SMD2  [SMD1,27-2,54]
U2  LM4562MAX/NOPB  [SOIC127P599X175-8N]
U3  TMUX1204DGSR  [SOP50P490X110-10N]
U4  TMUX1204DGSR  [SOP50P490X110-10N]
U5  TMUX1204DGSR  [SOP50P490X110-10N]
U11  TMUX1204DGSR  [SOP50P490X110-10N]
U$1  LC75281E  [QFP80P1720X1720X270-64N]
U$3  LC75281E  [QFP80P1720X1720X270-64N]
Y2  ECS-245.7-20-3X-EN-TR  [XTAL_ECS-245.7-20-3X-EN-TR]

## Nets
3V3A: C70.1 C71.1 IC2.8(AVDD) U2.1(OUT_A) U2.2(NEG_A)
3V3D: C68.1 C69.1 IC2.13(DVDD) IC2.14(IOVDD)
+3V3: 3V3_D1.1(P) U3.5(EN) U3.6(VDD) U4.5(EN) U4.6(VDD) U5.5(EN) U5.6(VDD) U11.5(EN) U11.6(VDD) ; supply symbol labelled +3V3_D
BCK_ADC: BCK_ADC1.1(P) IC2.17(BCK)
CLK_ADC: CLK_ADC1.1(P) IC2.15(SCKI)
CS: CS6.1(P) U11.8(D)
CS0: CS3.1(P) U3.8(D)
CS0_COMP1: 100POT1_COMP1.1(~CS) U3.2(S1)
CS0_COMP2: 100POT1_COMP3.1(~CS) U3.9(S2)
CS0_COMP3: 100POT1_COMP2.1(~CS) U3.4(S3)
CS0_COMP4: 100POT1_COMP5.1(~CS) U3.7(S4)
CS1: CS4.1(P) U5.8(D)
CS1_COMP1: 10POT1_COMP1.1(!CS) U5.2(S1)
CS1_COMP2: 10POT1_COMP3.1(!CS) U5.9(S2)
CS1_COMP3: 10POT1_COMP2.1(!CS) U5.4(S3)
CS1_COMP4: 10POT1_COMP5.1(!CS) U5.7(S4)
CS2: CS5.1(P) U4.8(D)
CS2_COMP1: 10POT2_COMP1.1(!CS) U4.2(S1)
CS2_COMP2: 10POT2_COMP3.1(!CS) U4.9(S2)
CS2_COMP3: 10POT2_COMP2.1(!CS) U4.4(S3)
CS2_COMP4: 10POT2_COMP5.1(!CS) U4.7(S4)
CS_PAN1: 10KPOT1_PAN1.1(!CS) U11.2(S1)
CS_PAN2: 10KPOT1_PAN3.1(!CS) U11.9(S2)
CS_PAN3: 10KPOT1_PAN2.1(!CS) U11.4(S3)
CS_PAN4: 10KPOT1_PAN4.1(!CS) U11.7(S4)
DOUT_ADC: DOUT_ADC1.1(P) IC2.18(DOUT)
EQ1_CE1: CE_EQ1.1(P) U$1.27(CE)
EQ2_CE3: CE_EQ2.1(P) U$3.27(CE)
GND: 10KPOT1_PAN1.4(VSS) 10KPOT1_PAN2.4(VSS) 10KPOT1_PAN3.4(VSS) 10KPOT1_PAN4.4(VSS) 10POT1_COMP1.4(VSS) 10POT1_COMP2.4(VSS) 10POT1_COMP3.4(VSS) 10POT1_COMP5.4(VSS) 10POT2_COMP1.4(VSS) 10POT2_COMP2.4(VSS) 10POT2_COMP3.4(VSS) 10POT2_COMP5.4(VSS) 100POT1_COMP1.4(VSS) 100POT1_COMP2.4(VSS) 100POT1_COMP3.4(VSS) 100POT1_COMP5.4(VSS) 200POT1_COMP1.5(GND) 200POT1_COMP1.9(EPAD) 200POT1_COMP2.5(GND) 200POT1_COMP2.9(EPAD) 200POT1_COMP3.5(GND) 200POT1_COMP3.9(EPAD) 200POT1_COMP5.5(GND) 200POT1_COMP5.9(EPAD) 200POT2_COMP1.4(A0) 200POT2_COMP1.5(GND) 200POT2_COMP1.9(EPAD) 200POT2_COMP2.4(A0) 200POT2_COMP2.5(GND) 200POT2_COMP2.9(EPAD) 200POT2_COMP3.4(A0) 200POT2_COMP3.5(GND) 200POT2_COMP3.9(EPAD) 200POT2_COMP5.4(A0) 200POT2_COMP5.5(GND) 200POT2_COMP5.9(EPAD) C28.2 C39.2 C68.2 C69.2 C70.2 C71.2 C72.2 C73.2 C74.2 C75.2 C76.2 C123.2 C134.2 GND1.1(P) GND2.1(P) GND3.1(P) GND4.1(P) GND5.1(P) GND6.1(P) GNDL1.1(P) GNDR1.1(P) IC2.7(AGND) IC2.12(DGND) IC2.25(MS/AD) OPAMP1_COMP1.4(V-) OPAMP1_COMP2.4(V-) OPAMP1_COMP3.4(V-) OPAMP1_COMP5.4(V-) OPAMP1_MIX1.4(V-) OPAMP1_PAN1.4(V-) OPAMP1_PAN2.4(V-) OPAMP1_PAN3.4(V-) OPAMP1_PAN4.4(V-) OPAMP2_COMP1.4(V-) OPAMP2_COMP2.4(V-) OPAMP2_COMP3.4(V-) OPAMP2_COMP5.4(V-) OPAMP3_COMP1.4(V-) OPAMP3_COMP2.4(V-) OPAMP3_COMP3.4(V-) OPAMP3_COMP5.4(V-) OPAMP4_COMP1.4(V-) OPAMP4_COMP2.4(V-) OPAMP4_COMP3.4(V-) OPAMP4_COMP5.4(V-) R5.1 R9.1 U2.4(V-) U3.3(GND) U4.3(GND) U5.3(GND) U11.3(GND) U$1.21(V_SS) U$1.28(TEST) U$3.21(V_SS) U$3.28(TEST) ; supply symbol labelled DGND
H1_COMP1: 200POT1_COMP1.8(H) 200POT2_COMP1.8(H) C44.1 OPAMP1_COMP1.6(NEG_B) R66.1
H1_COMP2: 200POT1_COMP3.8(H) 200POT2_COMP3.8(H) C50.1 OPAMP1_COMP3.6(NEG_B) R116.1
H1_COMP3: 200POT1_COMP2.8(H) 200POT2_COMP2.8(H) C47.1 OPAMP1_COMP2.6(NEG_B) R98.1
H1_COMP4: 200POT1_COMP5.8(H) 200POT2_COMP5.8(H) C56.1 OPAMP1_COMP5.6(NEG_B) R152.1
IN_COMP1: C43.2 IN_COMP1.1(P)
IN_COMP2: C49.2 IN_COMP3.1(P)
IN_COMP3: C46.2 IN_COMP2.1(P)
IN_COMP4: C55.2 IN_COMP5.1(P)
L1_COMP1: 200POT1_COMP1.6(L) 200POT1_COMP1.7(W) D19.1
L1_COMP2: 200POT1_COMP3.6(L) 200POT1_COMP3.7(W) D41.1
L1_COMP3: 200POT1_COMP2.6(L) 200POT1_COMP2.7(W) D30.1
L1_COMP4: 200POT1_COMP5.6(L) 200POT1_COMP5.7(W) D63.1
L2_COMP1: 200POT2_COMP1.6(L) 200POT2_COMP1.7(W) R94.2
L2_COMP2: 200POT2_COMP3.6(L) 200POT2_COMP3.7(W) R130.2
L2_COMP3: 200POT2_COMP2.6(L) 200POT2_COMP2.7(W) R112.2
L2_COMP4: 200POT2_COMP5.6(L) 200POT2_COMP5.7(W) R166.2
LRCK_ADC: IC2.16(LRCK) LRCK_ADC1.1(P)
MUX0: MUX2.1(P) U3.1(A0) U4.1(A0) U5.1(A0) U11.1(A0)
MUX1: MUX3.1(P) U3.10(A1) U4.10(A1) U5.10(A1) U11.10(A1)
N$2: C2.2 R6.2 R7.2 R10.2
N$3: C5.2 R15.2 R16.2 R17.2
N$4: C7.1 U$1.1(LLC1)
N$5: C10.1 U$1.6(LLMC1)
N$6: C11.1 U$1.7(LLMC4)
N$7: C12.1 U$1.11(LHMC1)
N$8: C3.1 R45.2
N$9: R32.1 R35.2 R39.2
N$10: R32.2 R34.2 R41.2 R42.2 R43.1
N$11: R31.2 R38.1 R42.1
N$12: R33.2 R37.1 R41.1
N$13: C13.1 U$1.12(LHMC4)
N$14: C14.1 U$1.16(LHC1)
N$15: C15.1 U$1.17(LHC4)
N$16: C16.1 U$1.32(RHC4)
N$17: C17.1 U$1.33(RHC1)
N$18: R34.1 R36.1 R40.2
N$19: C4.1 R60.2
N$20: R47.1 R50.2 R54.2
N$21: R47.2 R49.2 R56.2 R57.2 R58.1
N$22: R46.2 R53.1 R57.1
N$23: R48.2 R52.1 R56.1
N$24: R49.1 R51.1 R55.2
N$25: C18.1 U$1.37(RHMC4)
N$26: C6.2 R68.2 R69.2 R70.2
N$27: C19.1 U$1.38(RHMC1)
N$28: C8.2 R82.2 R83.2 R84.2
N$29: C20.1 U$1.42(RLMC4)
N$30: C21.1 U$1.43(RLMC1)
N$31: C22.1 U$1.47(RLC4)
N$32: C23.1 U$1.48(RLC1)
N$33: C7.2 U$1.64(LLC2)
N$34: C9.2 C24.2 U$1.3(LLC3)
N$35: C24.1 U$1.4(LLC5)
N$36: C25.1 U$1.9(LLMC5)
N$37: C26.1 U$1.14(LHMC5)
N$38: C27.1 U$1.19(LHC5)
N$39: C28.1 C39.1 U$1.23(V_REF)
N$40: C29.1 U$1.30(RHC5)
N$41: C30.1 U$1.35(RHMC5)
N$42: C31.1 U$1.40(RLMC5)
N$43: C32.1 U$1.45(RLC5)
N$44: C33.1 U$1.50(ROUT)
N$45: C34.1 U$1.52(RBOOS2)
N$46: C35.1 U$1.55(RCUT2)
N$47: C36.1 U$1.59(LCUT1)
N$48: C37.1 U$1.62(LBOOS1)
N$49: C38.1 U$1.63(LOUT)
N$50: C10.2 U$1.5(LLMC2)
N$51: C11.2 C25.2 U$1.8(LLMC3)
N$52: C12.2 U$1.10(LHMC2)
N$53: C13.2 C26.2 U$1.13(LHMC3)
N$54: C14.2 U$1.15(LHC2)
N$55: C15.2 C27.2 U$1.18(LHC3)
N$56: C16.2 C29.2 U$1.31(RHC3)
N$57: C17.2 U$1.34(RHC2)
N$58: C18.2 C30.2 U$1.36(RHMC3)
N$59: C19.2 U$1.39(RHMC2)
N$60: C20.2 C31.2 U$1.41(RLMC3)
N$61: C21.2 U$1.44(RLMC2)
N$62: C22.2 C32.2 U$1.46(RLC3)
N$63: C23.2 U$1.49(RLC2)
N$64: C34.2 U$1.51(RBOOS1)
N$65: C35.2 U$1.54(RCUT1)
N$66: C36.2 U$1.58(LCUT2)
N$67: C37.2 U$1.61(LBOOS2)
N$68: C9.1 U$1.2(LLC4)
N$70: R9.2 R22.2 U2.3(POS_A)
N$71: R5.2 R8.2 U2.5(POS_B)
N$74: D16.2 D17.1
N$75: D21.2 D22.1
N$76: D20.2 D21.1
N$77: C43.1 R91.2
N$78: D24.2 D25.1
N$79: D23.2 D24.1
N$80: D27.2 D28.1
N$81: D32.2 D33.1
N$82: D31.2 D32.1
N$83: C46.1 R109.2
N$84: D35.2 D36.1
N$85: D34.2 D35.1
N$86: D38.2 D39.1
N$87: D43.2 D44.1
N$88: D42.2 D43.1
N$89: C49.1 R127.2
N$90: D46.2 D47.1
N$91: D45.2 D46.1
N$98: D60.2 D61.1
N$99: D65.2 D66.1
N$100: D64.2 D65.1
N$101: C55.1 R163.2
N$102: D68.2 D69.1
N$103: D67.2 D68.1
N$114: C72.1 IC2.6(VREF)
N$115: C73.1 C74.1 IC2.11(LDO)
N$116: C75.1 IC2.9(XO) Y2.2
N$117: C76.1 IC2.10(XI) Y2.1
N$118: C84.2 IC2.1(VINL2/VIN1M)
N$119: C77.2 IC2.2(VINR2/VIN2M)
N$120: C103.1 U$3.1(LLC1)
N$121: C105.1 U$3.6(LLMC1)
N$122: C106.1 U$3.7(LLMC4)
N$123: C81.2 IC2.3(VINL1/VIN1P)
N$124: C107.1 U$3.11(LHMC1)
N$125: C78.2 IC2.4(VINR1/VIN2P)
N$126: C79.2 IC2.29(VINL3/VIN4P)
N$127: C83.2 IC2.28(VINR4/VIN3M)
N$128: C80.2 IC2.27(VINL4/VIN4M)
N$131: C108.1 U$3.12(LHMC4)
N$132: C109.1 U$3.16(LHC1)
N$135: C110.1 U$3.17(LHC4)
N$136: C111.1 U$3.32(RHC4)
N$137: C112.1 U$3.33(RHC1)
N$138: C113.1 U$3.37(RHMC4)
N$139: C114.1 U$3.38(RHMC1)
N$140: C115.1 U$3.42(RLMC4)
N$141: C116.1 U$3.43(RLMC1)
N$142: C117.1 U$3.47(RLC4)
N$143: C118.1 U$3.48(RLC1)
N$144: C103.2 U$3.64(LLC2)
N$145: C104.2 C119.2 U$3.3(LLC3)
N$146: C119.1 U$3.4(LLC5)
N$147: C120.1 U$3.9(LLMC5)
N$148: C121.1 U$3.14(LHMC5)
N$149: C122.1 U$3.19(LHC5)
N$150: C123.1 C134.1 U$3.23(V_REF)
N$151: C124.1 U$3.30(RHC5)
N$152: C125.1 U$3.35(RHMC5)
N$153: C126.1 U$3.40(RLMC5)
N$154: C127.1 U$3.45(RLC5)
N$155: C128.1 U$3.50(ROUT)
N$156: C129.1 U$3.52(RBOOS2)
N$157: C130.1 U$3.55(RCUT2)
N$158: C131.1 U$3.59(LCUT1)
N$159: C132.1 U$3.62(LBOOS1)
N$160: C133.1 U$3.63(LOUT)
N$161: C105.2 U$3.5(LLMC2)
N$162: C106.2 C120.2 U$3.8(LLMC3)
N$163: C107.2 U$3.10(LHMC2)
N$164: C108.2 C121.2 U$3.13(LHMC3)
N$165: C109.2 U$3.15(LHC2)
N$166: C110.2 C122.2 U$3.18(LHC3)
N$167: C111.2 C124.2 U$3.31(RHC3)
N$168: C112.2 U$3.34(RHC2)
N$169: C113.2 C125.2 U$3.36(RHMC3)
N$170: C114.2 U$3.39(RHMC2)
N$171: C115.2 C126.2 U$3.41(RLMC3)
N$172: C116.2 U$3.44(RLMC2)
N$173: C117.2 C127.2 U$3.46(RLC3)
N$174: C118.2 U$3.49(RLC2)
N$175: C129.2 U$3.51(RBOOS1)
N$176: C130.2 U$3.54(RCUT1)
N$177: C131.2 U$3.58(LCUT2)
N$178: C132.2 U$3.61(LBOOS2)
N$179: C104.1 U$3.2(LLC4)
N$183: C82.2 IC2.30(VINR3/VIN3P)
N$211: C42.1 D17.2 D18.1 D25.2 R65.1 R89.2
N$212: C48.1 D39.2 D40.1 D47.2 R115.1 R125.2
N$213: C45.1 D28.2 D29.1 D36.2 R97.1 R107.2
N$214: C54.1 D61.2 D62.1 D69.2 R151.1 R161.2
NEG_A1_COMP1: C42.2 D16.1 D18.2 OPAMP1_COMP1.2(NEG_A) R63.2
NEG_A1_COMP2: C48.2 D38.1 D40.2 OPAMP1_COMP3.2(NEG_A) R113.2
NEG_A1_COMP3: C45.2 D27.1 D29.2 OPAMP1_COMP2.2(NEG_A) R95.2
NEG_A1_COMP4: C54.2 D60.1 D62.2 OPAMP1_COMP5.2(NEG_A) R149.2
NEG_A2_COMP1: OPAMP2_COMP1.2(NEG_A) R67.2 R75.1
NEG_A2_COMP2: OPAMP2_COMP3.2(NEG_A) R117.2 R118.1
NEG_A2_COMP3: OPAMP2_COMP2.2(NEG_A) R99.2 R100.1
NEG_A2_COMP4: OPAMP2_COMP5.2(NEG_A) R153.2 R154.1
NEG_A3_COMP1: OPAMP3_COMP1.2(NEG_A) R77.1 R78.2
NEG_A3_COMP2: OPAMP3_COMP3.2(NEG_A) R120.1 R121.2
NEG_A3_COMP3: OPAMP3_COMP2.2(NEG_A) R102.1 R103.2
NEG_A3_COMP4: OPAMP3_COMP5.2(NEG_A) R156.1 R157.2
NEG_A4_COMP1: OPAMP4_COMP1.2(NEG_A) R79.2 R80.2
NEG_A4_COMP2: OPAMP4_COMP3.2(NEG_A) R122.2 R123.2
NEG_A4_COMP3: OPAMP4_COMP2.2(NEG_A) R104.2 R105.2
NEG_A4_COMP4: OPAMP4_COMP5.2(NEG_A) R158.2 R159.2
NEG_A_MIX: OPAMP1_MIX1.2(NEG_A) R43.2 R44.1
NEG_A_PAN1: OPAMP1_PAN1.2(NEG_A) R71.1 R74.1
NEG_A_PAN2: OPAMP1_PAN3.2(NEG_A) R85.1 R88.1
NEG_A_PAN3: OPAMP1_PAN2.2(NEG_A) R11.1 R14.1
NEG_A_PAN4: OPAMP1_PAN4.2(NEG_A) R18.1 R21.1
NEG_B2_COMP1: OPAMP2_COMP1.6(NEG_B) OPAMP2_COMP1.7(OUT_B) R93.2
NEG_B2_COMP2: OPAMP2_COMP3.6(NEG_B) OPAMP2_COMP3.7(OUT_B) R129.2
NEG_B2_COMP3: OPAMP2_COMP2.6(NEG_B) OPAMP2_COMP2.7(OUT_B) R111.2
NEG_B2_COMP4: OPAMP2_COMP5.6(NEG_B) OPAMP2_COMP5.7(OUT_B) R165.2
NEG_B3_COMP1: OPAMP3_COMP1.6(NEG_B) R89.1 R90.2
NEG_B3_COMP2: OPAMP3_COMP3.6(NEG_B) R125.1 R126.2
NEG_B3_COMP3: OPAMP3_COMP2.6(NEG_B) R107.1 R108.2
NEG_B3_COMP4: OPAMP3_COMP5.6(NEG_B) R161.1 R162.2
NEG_B4_COMP1: 100POT1_COMP1.5(PB1) OPAMP4_COMP1.6(NEG_B) R81.2
NEG_B4_COMP2: 100POT1_COMP3.5(PB1) OPAMP4_COMP3.6(NEG_B) R124.2
NEG_B4_COMP3: 100POT1_COMP2.5(PB1) OPAMP4_COMP2.6(NEG_B) R106.2
NEG_B4_COMP4: 100POT1_COMP5.5(PB1) OPAMP4_COMP5.6(NEG_B) R160.2
NEG_B_MIX: OPAMP1_MIX1.6(NEG_B) R58.2 R59.1
NEG_B_PAN1: OPAMP1_PAN1.6(NEG_B) R72.2 R73.2
NEG_B_PAN2: OPAMP1_PAN3.6(NEG_B) R86.2 R87.2
NEG_B_PAN3: OPAMP1_PAN2.6(NEG_B) R12.2 R13.2
NEG_B_PAN4: OPAMP1_PAN4.6(NEG_B) R19.2 R20.2
OUT1_EQ1: C6.1 C33.2 PAD16.1(P)
OUT1_EQ2: C5.1 C128.2 PAD14.1(P)
OUT2_EQ1: C8.1 C38.2 PAD15.1(P)
OUT2_EQ2: C2.1 C133.2 PAD13.1(P)
OUT_A1_COMP1: OPAMP1_COMP1.1(OUT_A) R65.2
OUT_A1_COMP2: OPAMP1_COMP3.1(OUT_A) R115.2
OUT_A1_COMP3: OPAMP1_COMP2.1(OUT_A) R97.2
OUT_A1_COMP4: OPAMP1_COMP5.1(OUT_A) R151.2
OUT_A2_COMP1: 100POT1_COMP1.10(PB0) OPAMP2_COMP1.1(OUT_A) R75.2
OUT_A2_COMP2: 100POT1_COMP3.10(PB0) OPAMP2_COMP3.1(OUT_A) R118.2
OUT_A2_COMP3: 100POT1_COMP2.10(PB0) OPAMP2_COMP2.1(OUT_A) R100.2
OUT_A2_COMP4: 100POT1_COMP5.10(PB0) OPAMP2_COMP5.1(OUT_A) R154.2
OUT_A3_COMP1: D26.2 OPAMP3_COMP1.1(OUT_A)
OUT_A3_COMP2: D48.2 OPAMP3_COMP3.1(OUT_A)
OUT_A3_COMP3: D37.2 OPAMP3_COMP2.1(OUT_A)
OUT_A3_COMP4: D70.2 OPAMP3_COMP5.1(OUT_A)
OUT_A4_COMP1: OPAMP4_COMP1.1(OUT_A) OPAMP4_COMP1.5(POS_B) R78.1 R79.1
OUT_A4_COMP2: OPAMP4_COMP3.1(OUT_A) OPAMP4_COMP3.5(POS_B) R121.1 R122.1
OUT_A4_COMP3: OPAMP4_COMP2.1(OUT_A) OPAMP4_COMP2.5(POS_B) R103.1 R104.1
OUT_A4_COMP4: OPAMP4_COMP5.1(OUT_A) OPAMP4_COMP5.5(POS_B) R157.1 R158.1
OUT_A_MIX: OPAMP1_MIX1.1(OUT_A) R44.2 R45.1
OUT_B1_COMP1: D19.2 OPAMP1_COMP1.7(OUT_B)
OUT_B1_COMP2: D41.2 OPAMP1_COMP3.7(OUT_B)
OUT_B1_COMP3: D30.2 OPAMP1_COMP2.7(OUT_B)
OUT_B1_COMP4: D63.2 OPAMP1_COMP5.7(OUT_B)
OUT_B3_COMP1: D20.1 OPAMP3_COMP1.7(OUT_B) R90.1
OUT_B3_COMP2: D42.1 OPAMP3_COMP3.7(OUT_B) R126.1
OUT_B3_COMP3: D31.1 OPAMP3_COMP2.7(OUT_B) R108.1
OUT_B3_COMP4: D64.1 OPAMP3_COMP5.7(OUT_B) R162.1
OUT_B_MIX: OPAMP1_MIX1.7(OUT_B) R59.2 R60.1
OUT_COMP1: 100POT1_COMP1.6(PW1) 100POT1_COMP1.7(PA1) OPAMP4_COMP1.7(OUT_B) PAD10.1(P) U$1.60(LIN)
OUT_COMP2: 100POT1_COMP3.6(PW1) 100POT1_COMP3.7(PA1) OPAMP4_COMP3.7(OUT_B) PAD9.1(P) U$1.53(RIN)
OUT_COMP3: 100POT1_COMP2.6(PW1) 100POT1_COMP2.7(PA1) OPAMP4_COMP2.7(OUT_B) PAD12.1(P) U$3.60(LIN)
OUT_COMP4: 100POT1_COMP5.6(PW1) 100POT1_COMP5.7(PA1) OPAMP4_COMP5.7(OUT_B) PAD11.1(P) U$3.53(RIN)
OUTL_MIX1: C3.2 OUTL_MIX1.1(P)
OUTL_PAN1: C79.1 OPAMP1_PAN1.1(OUT_A) PAD3.1(P) R55.1 R74.2
OUTL_PAN2: C80.1 OPAMP1_PAN3.1(OUT_A) PAD5.1(P) R31.1 R88.2
OUTL_PAN3: C78.1 OPAMP1_PAN2.1(OUT_A) PAD1.1(P) R14.2 R46.1
OUTL_PAN4: C84.1 OPAMP1_PAN4.1(OUT_A) PAD7.1(P) R21.2 R40.1
OUTR_MIX1: C4.2 OUTR_MIX1.1(P)
OUTR_PAN1: C82.1 OPAMP1_PAN1.7(OUT_B) PAD6.1(P) R33.1 R72.1
OUTR_PAN2: C83.1 OPAMP1_PAN3.7(OUT_B) PAD4.1(P) R54.1 R86.1
OUTR_PAN3: C81.1 OPAMP1_PAN2.7(OUT_B) PAD8.1(P) R12.1 R39.1
OUTR_PAN4: C77.1 OPAMP1_PAN4.7(OUT_B) PAD2.1(P) R19.1 R48.1
P0A1_COMP1: 10POT1_COMP1.5(P0A) R76.2
P0A1_COMP2: 10POT1_COMP3.5(P0A) R119.2
P0A1_COMP3: 10POT1_COMP2.5(P0A) R101.2
P0A1_COMP4: 10POT1_COMP5.5(P0A) R155.2
P0A2_COMP1: 10POT2_COMP1.5(P0A) R92.1
P0A2_COMP2: 10POT2_COMP3.5(P0A) R128.1
P0A2_COMP3: 10POT2_COMP2.5(P0A) R110.1
P0A2_COMP4: 10POT2_COMP5.5(P0A) R164.1
P0A_PAN1: 10KPOT1_PAN1.5(P0A) R70.1 R71.2
P0A_PAN2: 10KPOT1_PAN3.5(P0A) R84.1 R85.2
P0A_PAN3: 10KPOT1_PAN2.5(P0A) R10.1 R11.2
P0A_PAN4: 10KPOT1_PAN4.5(P0A) R17.1 R18.2
P0B_PAN1: 10KPOT1_PAN1.7(P0B) R69.1 R73.1
P0B_PAN2: 10KPOT1_PAN3.7(P0B) R83.1 R87.1
P0B_PAN3: 10KPOT1_PAN2.7(P0B) R7.1 R13.1
P0B_PAN4: 10KPOT1_PAN4.7(P0B) R16.1 R20.1
P0W1_COMP1: 10POT1_COMP1.6(P0W) R67.1
P0W1_COMP2: 10POT1_COMP3.6(P0W) R117.1
P0W1_COMP3: 10POT1_COMP2.6(P0W) R99.1
P0W1_COMP4: 10POT1_COMP5.6(P0W) R153.1
P0W_PAN1: 10KPOT1_PAN1.6(P0W) D2.1
P0W_PAN2: 10KPOT1_PAN3.6(P0W) D4.1
P0W_PAN3: 10KPOT1_PAN2.6(P0W) D3.1
P0W_PAN4: 10KPOT1_PAN4.6(P0W) D5.1
POS_A1_COMP1: 100POT1_COMP1.9(PW0) OPAMP1_COMP1.3(POS_A)
POS_A1_COMP2: 100POT1_COMP3.9(PW0) OPAMP1_COMP3.3(POS_A)
POS_A1_COMP3: 100POT1_COMP2.9(PW0) OPAMP1_COMP2.3(POS_A)
POS_A1_COMP4: 100POT1_COMP5.9(PW0) OPAMP1_COMP5.3(POS_A)
POS_A2_COMP1: OPAMP2_COMP1.3(POS_A) R64.2 R66.2
POS_A2_COMP2: OPAMP2_COMP3.3(POS_A) R114.2 R116.2
POS_A2_COMP3: OPAMP2_COMP2.3(POS_A) R96.2 R98.2
POS_A2_COMP4: OPAMP2_COMP5.3(POS_A) R150.2 R152.2
POS_A4_COMP1: D22.2 D23.1 OPAMP4_COMP1.3(POS_A) R93.1
POS_A4_COMP2: D44.2 D45.1 OPAMP4_COMP3.3(POS_A) R129.1
POS_A4_COMP3: D33.2 D34.1 OPAMP4_COMP2.3(POS_A) R111.1
POS_A4_COMP4: D66.2 D67.1 OPAMP4_COMP5.3(POS_A) R165.1
POS_B1_COMP1: D26.1 OPAMP1_COMP1.5(POS_B) R77.2
POS_B1_COMP2: D48.1 OPAMP1_COMP3.5(POS_B) R120.2
POS_B1_COMP3: D37.1 OPAMP1_COMP2.5(POS_B) R102.2
POS_B1_COMP4: D70.1 OPAMP1_COMP5.5(POS_B) R156.2
POS_B2_COMP1: 10POT2_COMP1.6(P0W) 10POT2_COMP1.7(P0B) OPAMP2_COMP1.5(POS_B) R91.1
POS_B2_COMP2: 10POT2_COMP3.6(P0W) 10POT2_COMP3.7(P0B) OPAMP2_COMP3.5(POS_B) R127.1
POS_B2_COMP3: 10POT2_COMP2.6(P0W) 10POT2_COMP2.7(P0B) OPAMP2_COMP2.5(POS_B) R109.1
POS_B2_COMP4: 10POT2_COMP5.6(P0W) 10POT2_COMP5.7(P0B) OPAMP2_COMP5.5(POS_B) R163.1
SCK: 10KPOT1_PAN1.2(SCK) 10KPOT1_PAN2.2(SCK) 10KPOT1_PAN3.2(SCK) 10KPOT1_PAN4.2(SCK) 10POT1_COMP1.2(SCK) 10POT1_COMP2.2(SCK) 10POT1_COMP3.2(SCK) 10POT1_COMP5.2(SCK) 10POT2_COMP1.2(SCK) 10POT2_COMP2.2(SCK) 10POT2_COMP3.2(SCK) 10POT2_COMP5.2(SCK) 100POT1_COMP1.2(SCK) 100POT1_COMP2.2(SCK) 100POT1_COMP3.2(SCK) 100POT1_COMP5.2(SCK) SCK1.1(P) U$1.25(CL) U$3.25(CL)
SCL: 200POT1_COMP1.2(SCL) 200POT1_COMP2.2(SCL) 200POT1_COMP3.2(SCL) 200POT1_COMP5.2(SCL) 200POT2_COMP1.2(SCL) 200POT2_COMP2.2(SCL) 200POT2_COMP3.2(SCL) 200POT2_COMP5.2(SCL) SCL1.1(P)
SCL1: IC2.24(MC/SCL) SCL2.1(P)
SDA: 200POT1_COMP1.3(SDA) 200POT1_COMP2.3(SDA) 200POT1_COMP3.3(SDA) 200POT1_COMP5.3(SDA) 200POT2_COMP1.3(SDA) 200POT2_COMP2.3(SDA) 200POT2_COMP3.3(SDA) 200POT2_COMP5.3(SDA) SDA1.1(P)
SDA1: IC2.23(MOSI/SDA) SDA2.1(P)
SDI/O: 10KPOT1_PAN1.3(SDI/SDO) 10KPOT1_PAN2.3(SDI/SDO) 10KPOT1_PAN3.3(SDI/SDO) 10KPOT1_PAN4.3(SDI/SDO) 10POT1_COMP1.3(SDI/SDO) 10POT1_COMP2.3(SDI/SDO) 10POT1_COMP3.3(SDI/SDO) 10POT1_COMP5.3(SDI/SDO) 10POT2_COMP1.3(SDI/SDO) 10POT2_COMP2.3(SDI/SDO) 10POT2_COMP3.3(SDI/SDO) 10POT2_COMP5.3(SDI/SDO) 100POT1_COMP1.3(SI) 100POT1_COMP2.3(SI) 100POT1_COMP3.3(SI) 100POT1_COMP5.3(SI) SDI/O1.1(P) U$1.26(DI) U$3.26(DI)
VDD: 9VDD1.1(P) OPAMP1_COMP1.8(V+) OPAMP1_COMP2.8(V+) OPAMP1_COMP3.8(V+) OPAMP1_COMP5.8(V+) OPAMP1_MIX1.8(V+) OPAMP1_PAN1.8(V+) OPAMP1_PAN2.8(V+) OPAMP1_PAN3.8(V+) OPAMP1_PAN4.8(V+) OPAMP2_COMP1.8(V+) OPAMP2_COMP2.8(V+) OPAMP2_COMP3.8(V+) OPAMP2_COMP5.8(V+) OPAMP3_COMP1.8(V+) OPAMP3_COMP2.8(V+) OPAMP3_COMP3.8(V+) OPAMP3_COMP5.8(V+) OPAMP4_COMP1.8(V+) OPAMP4_COMP2.8(V+) OPAMP4_COMP3.8(V+) OPAMP4_COMP5.8(V+) R8.1 R22.1 R76.1 R101.1 R119.1 R155.1 U2.8(V+) U$1.22(V_DD) U$3.22(V_DD)
VREF: 10KPOT1_PAN1.8(VDD) 10KPOT1_PAN2.8(VDD) 10KPOT1_PAN3.8(VDD) 10KPOT1_PAN4.8(VDD) 10POT1_COMP1.7(P0B) 10POT1_COMP1.8(VDD) 10POT1_COMP2.7(P0B) 10POT1_COMP2.8(VDD) 10POT1_COMP3.7(P0B) 10POT1_COMP3.8(VDD) 10POT1_COMP5.7(P0B) 10POT1_COMP5.8(VDD) 10POT2_COMP1.8(VDD) 10POT2_COMP2.8(VDD) 10POT2_COMP3.8(VDD) 10POT2_COMP5.8(VDD) 100POT1_COMP1.8(PA0) 100POT1_COMP1.11(~RS) 100POT1_COMP1.12(~SHDN) 100POT1_COMP1.14(VDD) 100POT1_COMP2.8(PA0) 100POT1_COMP2.11(~RS) 100POT1_COMP2.12(~SHDN) 100POT1_COMP2.14(VDD) 100POT1_COMP3.8(PA0) 100POT1_COMP3.11(~RS) 100POT1_COMP3.12(~SHDN) 100POT1_COMP3.14(VDD) 100POT1_COMP5.8(PA0) 100POT1_COMP5.11(~RS) 100POT1_COMP5.12(~SHDN) 100POT1_COMP5.14(VDD) 200POT1_COMP1.1(VDD) 200POT1_COMP1.4(A0) 200POT1_COMP2.1(VDD) 200POT1_COMP2.4(A0) 200POT1_COMP3.1(VDD) 200POT1_COMP3.4(A0) 200POT1_COMP5.1(VDD) 200POT1_COMP5.4(A0) 200POT2_COMP1.1(VDD) 200POT2_COMP2.1(VDD) 200POT2_COMP3.1(VDD) 200POT2_COMP5.1(VDD) C44.2 C47.2 C50.2 C56.2 D2.2 D3.2 D4.2 D5.2 OPAMP1_MIX1.3(POS_A) OPAMP1_MIX1.5(POS_B) OPAMP1_PAN1.3(POS_A) OPAMP1_PAN1.5(POS_B) OPAMP1_PAN2.3(POS_A) OPAMP1_PAN2.5(POS_B) OPAMP1_PAN3.3(POS_A) OPAMP1_PAN3.5(POS_B) OPAMP1_PAN4.3(POS_A) OPAMP1_PAN4.5(POS_B) OPAMP3_COMP1.3(POS_A) OPAMP3_COMP1.5(POS_B) OPAMP3_COMP2.3(POS_A) OPAMP3_COMP2.5(POS_B) OPAMP3_COMP3.3(POS_A) OPAMP3_COMP3.5(POS_B) OPAMP3_COMP5.3(POS_A) OPAMP3_COMP5.5(POS_B) R6.1 R15.1 R35.1 R36.2 R37.2 R38.2 R50.1 R51.2 R52.2 R53.2 R63.1 R64.1 R68.1 R80.1 R81.1 R82.1 R92.2 R94.1 R95.1 R96.1 R105.1 R106.1 R110.2 R112.1 R113.1 R114.1 R123.1 R124.1 R128.2 R130.1 R149.1 R150.1 R159.1 R160.1 R164.2 R166.1 U2.6(NEG_B) U2.7(OUT_B)
Unconnected: 100POT1_COMP1.13(SO) 100POT1_COMP2.13(SO) 100POT1_COMP3.13(SO) 100POT1_COMP5.13(SO) IC2.5(MIC_BIAS) IC2.19(GPIO3/INTC) IC2.20(GPIO1/INTB/DMCLK) IC2.21(GPIO1/INTA/DMIN) IC2.22(MISO/GPIO0/DMIN2) IC2.26(MD0) U$1.20(NC) U$1.24(NC) U$1.29(NC) U$1.56(NC) U$1.57(NC) U$3.20(NC) U$3.24(NC) U$3.29(NC) U$3.56(NC) U$3.57(NC)

## Library data of the parts
3V3_D1 9VDD1 BCK_ADC1 CE_EQ1 CE_EQ2 CLK_ADC1 CS3-CS6 DOUT_ADC1 GND4 GND6 LRCK_ADC1 MUX2 MUX3 PAD1-PAD16 SCK1 SCL1 SCL2 SDA1 SDA2 SDI/O1 = wirepad:SMD2: SMD PAD
10KPOT1_PAN1-10KPOT1_PAN4 = MCP4131-503E_SN:MCP4131-503E/SN: Check availability <https://pricing.snapeda.com/parts/MCP4131-503E/SN/Microchip/view-part?ref=eda>; AVAILABILITY: In Stock; CHECK_PRICES: https://www.snapeda.com/parts/MCP4131-503E/SN/Microchip/view-part/?ref=eda; DESCRIPTION: MCP4131-503E/SN,Digi Potentiometer 50kOhm 129-Pos Linear Serial-SPI 8-Pin SOIC | Microchip Technology Inc. MCP4131-503E/SN; MF: Microchip; MP: MCP4131-503E/SN; PACKAGE: SOIC-8 Microchip; PRICE: None; PURCHASE-URL: https://www.snapeda.com/api/url_track_click_mouser/?unipart_id=129576&manufacturer=Microchip&part_name=MCP4131-503E/SN&search_term=mcp413; SNAPEDA_LINK: https://www.snapeda.com/parts/MCP4131-503E/SN/Microchip/view-part/?ref=snap; SPICEPREFIX: X
10POT1_COMP1-10POT1_COMP3 10POT1_COMP5 10POT2_COMP1-10POT2_COMP3 10POT2_COMP5 = MCP4131-503E_SN:MCP4131-503E/SN: Check availability <https://pricing.snapeda.com/parts/MCP4131-503E/SN/Microchip/view-part?ref=eda>; AVAILABILITY: In Stock; CHECK_PRICES: https://www.snapeda.com/parts/MCP4131-503E/SN/Microchip/view-part/?ref=eda; DESCRIPTION: MCP4131-503E/SN,Digi Potentiometer 50kOhm 129-Pos Linear Serial-SPI 8-Pin SOIC | Microchip Technology Inc. MCP4131-503E/SN; MF: Microchip; MP: MCP4131-503E/SN; PACKAGE: SOIC-8 Microchip; PRICE: None; PURCHASE-URL: https://www.snapeda.com/api/url_track_click_mouser/?unipart_id=129576&manufacturer=Microchip&part_name=MCP4131-503E/SN&search_term=mcp413; SNAPEDA_LINK: https://www.snapeda.com/parts/MCP4131-503E/SN/Microchip/view-part/?ref=snap
100POT1_COMP1-100POT1_COMP3 100POT1_COMP5 = MCP42100-I_P:MCP42100-I/P: Digital Potentiometer Check availability <https://pricing.snapeda.com/parts/MCP42100-I/P/Microchip/view-part?ref=eda>; AVAILABILITY: In Stock; CHECK_PRICES: https://www.snapeda.com/parts/MCP42100-I/P/Microchip/view-part/?ref=eda; DESCRIPTION: Pot,Digital;Rest 100 Kilohms;Digital;256 Pos;14 Pins;2 Ch;Pkg DIP | Microchip Technology Inc. MCP42100-I/P; MF: Microchip; MP: MCP42100-I/P; PACKAGE: DIP-14 Microchip; PRICE: None; PURCHASE-URL: https://www.snapeda.com/api/url_track_click_mouser/?unipart_id=40874&manufacturer=Microchip&part_name=MCP42100-I/P&search_term=mcp42100; SNAPEDA_LINK: https://www.snapeda.com/parts/MCP42100-I/P/Microchip/view-part/?ref=snap
200POT1_COMP1 200POT2_COMP1 = MAX5419NETA_:MAX5419NETA+: Check availability <https://pricing.snapeda.com/parts/MAX5419NETA%2B/Analog%20Devices/view-part?ref=eda>; AVAILABILITY: In Stock; CHECK_PRICES: https://www.snapeda.com/parts/MAX5419NETA+/Analog+Devices/view-part/?ref=eda; DESCRIPTION: 256-Tap, Nonvolatile, I²C-Interface, Digital Potentiometers; MF: Analog Devices; MP: MAX5419NETA+; PACKAGE: TDFN-EP-8 Maxim; PRICE: None; PURCHASE-URL: https://www.snapeda.com/api/url_track_click_mouser/?unipart_id=632563&manufacturer=Analog Devices&part_name=MAX5419NETA+&search_term=max5419; SNAPEDA_LINK: https://www.snapeda.com/parts/MAX5419NETA+/Analog+Devices/view-part/?ref=snap
200POT1_COMP2 200POT2_COMP2 = MAX5419LETA_:MAX5419META+: Check availability <https://pricing.snapeda.com/parts/MAX5419LETA%2B/Analog%20Devices/view-part?ref=eda>; AVAILABILITY: In Stock; CHECK_PRICES: https://www.snapeda.com/parts/MAX5419LETA+/Analog+Devices/view-part/?ref=eda; DESCRIPTION: 256-Tap, Nonvolatile, I²C-Interface, Digital Potentiometers; MF: Analog Devices; MP: MAX5419LETA+; PACKAGE: TDFN-EP-8 Maxim; PRICE: None; PURCHASE-URL: https://www.snapeda.com/api/url_track_click_mouser/?unipart_id=895758&manufacturer=Analog Devices&part_name=MAX5419LETA+&search_term=max541; SNAPEDA_LINK: https://www.snapeda.com/parts/MAX5419LETA+/Analog+Devices/view-part/?ref=snap
200POT1_COMP3 200POT2_COMP3 = MAX5419PETAT:MAX5419PETAT: Check availability <https://pricing.snapeda.com/parts/MAX5419PETA%2B/Analog%20Devices/view-part?ref=eda>; AVAILABILITY: In Stock; CHECK_PRICES: https://www.snapeda.com/parts/MAX5419PETA+/Analog+Devices/view-part/?ref=eda; DESCRIPTION: 256-Tap, Nonvolatile, I²C-Interface, Digital Potentiometers; MF: Analog Devices; MP: MAX5419PETA+; PACKAGE: TDFN-EP-8 Maxim; PRICE: None; PURCHASE-URL: https://www.snapeda.com/api/url_track_click_mouser/?unipart_id=632565&manufacturer=Analog Devices&part_name=MAX5419PETA+&search_term=max5419; SNAPEDA_LINK: https://www.snapeda.com/parts/MAX5419PETA+/Analog+Devices/view-part/?ref=snap
200POT1_COMP5 200POT2_COMP5 = MAX5419LETA_:MAX5419LETA+: Check availability <https://pricing.snapeda.com/parts/MAX5419LETA%2B/Analog%20Devices/view-part?ref=eda>; AVAILABILITY: In Stock; CHECK_PRICES: https://www.snapeda.com/parts/MAX5419LETA+/Analog+Devices/view-part/?ref=eda; DESCRIPTION: 256-Tap, Nonvolatile, I²C-Interface, Digital Potentiometers; MF: Analog Devices; MP: MAX5419LETA+; PACKAGE: TDFN-EP-8 Maxim; PRICE: None; PURCHASE-URL: https://www.snapeda.com/api/url_track_click_mouser/?unipart_id=895758&manufacturer=Analog Devices&part_name=MAX5419LETA+&search_term=max541; SNAPEDA_LINK: https://www.snapeda.com/parts/MAX5419LETA+/Analog+Devices/view-part/?ref=snap
C2-C39 C42-C50 C54-C56 C68-C84 C103-C134 = rcl:C-US: CAPACITOR, American symbol; SPICEPREFIX: C
D2-D5 D16-D48 D60-D70 = 1N4148W-TP(1):1N4148W-TP: Check availability <https://pricing.snapeda.com/parts/1N4148WTP/Diodes%20Inc./view-part?ref=eda>; AVAILABILITY: Not in stock; CHECK_PRICES: https://www.snapeda.com/parts/1N4148WTP/Diodes+Inc./view-part/?ref=eda; DESCRIPTION: Diodes - General Purpose, Power, Switching 100Vrm 71Vr 150mA 4.0A 100mW 1.5pF; MF: Diodes Inc.; MP: 1N4148WTP; PACKAGE: None; PRICE: None; SNAPEDA_LINK: https://www.snapeda.com/parts/1N4148WTP/Diodes+Inc./view-part/?ref=snap
GND1-GND3 GND5 GNDL1 GNDR1 IN_COMP1-IN_COMP3 IN_COMP5 OUTL_MIX1 OUTR_MIX1 = wirepad:SMD5: SMD PAD
IC2 = PCM1865DBT:PCM1865DBT: CS item no.: CS description: PCM186x 4-Channel or 2-Channel, 192-kHz, Audio ADCs Specification: http://www.ti.com Check availability <https://pricing.snapeda.com/parts/PCM1865DBT/Texas%20Instruments/view-part?ref=eda>; AVAILABILITY: In Stock; CHECK_PRICES: https://www.snapeda.com/parts/PCM1865DBT/Texas+Instruments/view-part/?ref=eda; DESCRIPTION: 110dB 4-Channel Software-Controlled Audio ADC With Universal Front End; MF: Texas Instruments; MP: PCM1865DBT; PACKAGE: TSSOP-30 Texas Instruments; PRICE: None; PURCHASE-URL: https://www.snapeda.com/api/url_track_click_mouser/?unipart_id=554870&manufacturer=Texas Instruments&part_name=PCM1865DBT&search_term=pcm186; SNAPEDA_LINK: https://www.snapeda.com/parts/PCM1865DBT/Texas+Instruments/view-part/?ref=snap
OPAMP1_COMP1-OPAMP1_COMP3 OPAMP1_COMP5 OPAMP1_MIX1 OPAMP1_PAN1-OPAMP1_PAN4 OPAMP2_COMP1-OPAMP2_COMP3 OPAMP2_COMP5 OPAMP3_COMP1-OPAMP3_COMP3 OPAMP3_COMP5 OPAMP4_COMP1-OPAMP4_COMP3 OPAMP4_COMP5 U2 = LM4562MAX_NOPB:LM4562MAX/NOPB: Check availability <https://pricing.snapeda.com/parts/LM4562MAX/NOPB/Texas%20Instruments/view-part?ref=eda>; AVAILABILITY: In Stock; CHECK_PRICES: https://www.snapeda.com/parts/LM4562MAX/NOPB/Texas+Instruments/view-part/?ref=eda; DESCRIPTION: 2-channel, 55-MHz, high-fidelity, high performance audio op amp; MF: Texas Instruments; MP: LM4562MAX/NOPB; PACKAGE: SOIC-8 Texas Instruments; PRICE: None; PURCHASE-URL: https://www.snapeda.com/api/url_track_click_mouser/?unipart_id=21165&manufacturer=Texas Instruments&part_name=LM4562MAX/NOPB&search_term=lm4562; SNAPEDA_LINK: https://www.snapeda.com/parts/LM4562MAX/NOPB/Texas+Instruments/view-part/?ref=snap
R5-R22 R31-R60 R63-R130 R149-R166 = rcl:R-US_: RESISTOR, American symbol; SPICEPREFIX: R
U3-U5 U11 = TMUX1204DGSR:TMUX1204DGSR: Check availability <https://pricing.snapeda.com/parts/TMUX1204DGSR/Texas%20Instruments/view-part?ref=eda>; AVAILABILITY: In Stock; CHECK_PRICES: https://www.snapeda.com/parts/TMUX1204DGSR/Texas+Instruments/view-part/?ref=eda; DESCRIPTION: 5-V, 4:1, 1-channel, general-purpose analog multiplexer; MF: Texas Instruments; MP: TMUX1204DGSR; PACKAGE: VSSOP-10 Texas Instruments; PRICE: None; PURCHASE-URL: https://www.snapeda.com/api/url_track_click_mouser/?unipart_id=3657556&manufacturer=Texas Instruments&part_name=TMUX1204DGSR&search_term=tmux1204; SNAPEDA_LINK: https://www.snapeda.com/parts/TMUX1204DGSR/Texas+Instruments/view-part/?ref=snap
U$1 U$3 = LC75281E:LC75281E
Y2 = ECS-245.7-20-3X-EN-TR:ECS-245.7-20-3X-EN-TR: SMD QUARTZ CRYSTAL Check availability <https://pricing.snapeda.com/parts/ECS-245.7-20-3X-EN-TR/ECS%20Inc./view-part?ref=eda>; AVAILABILITY: In Stock; CHECK_PRICES: https://www.snapeda.com/parts/ECS-245.7-20-3X-EN-TR/ECS+Inc./view-part/?ref=eda; DESCRIPTION: 24.576 MHz ±30ppm Crystal 20pF 50 Ohms HC-49/US; MF: ECS Inc.; MP: ECS-245.7-20-3X-EN-TR; PACKAGE: HC49/US ECS International; PRICE: None; PURCHASE-URL: https://www.snapeda.com/api/url_track_click_mouser/?unipart_id=2461373&manufacturer=ECS Inc.&part_name=ECS-245.7-20-3X-EN-TR&search_term=ecs-245.7-20-3x-en-tr; SNAPEDA_LINK: https://www.snapeda.com/parts/ECS-245.7-20-3X-EN-TR/ECS+Inc./view-part/?ref=snap